# Altium project TMDX654GPEVM.PrjPcb (part 1 of 24)
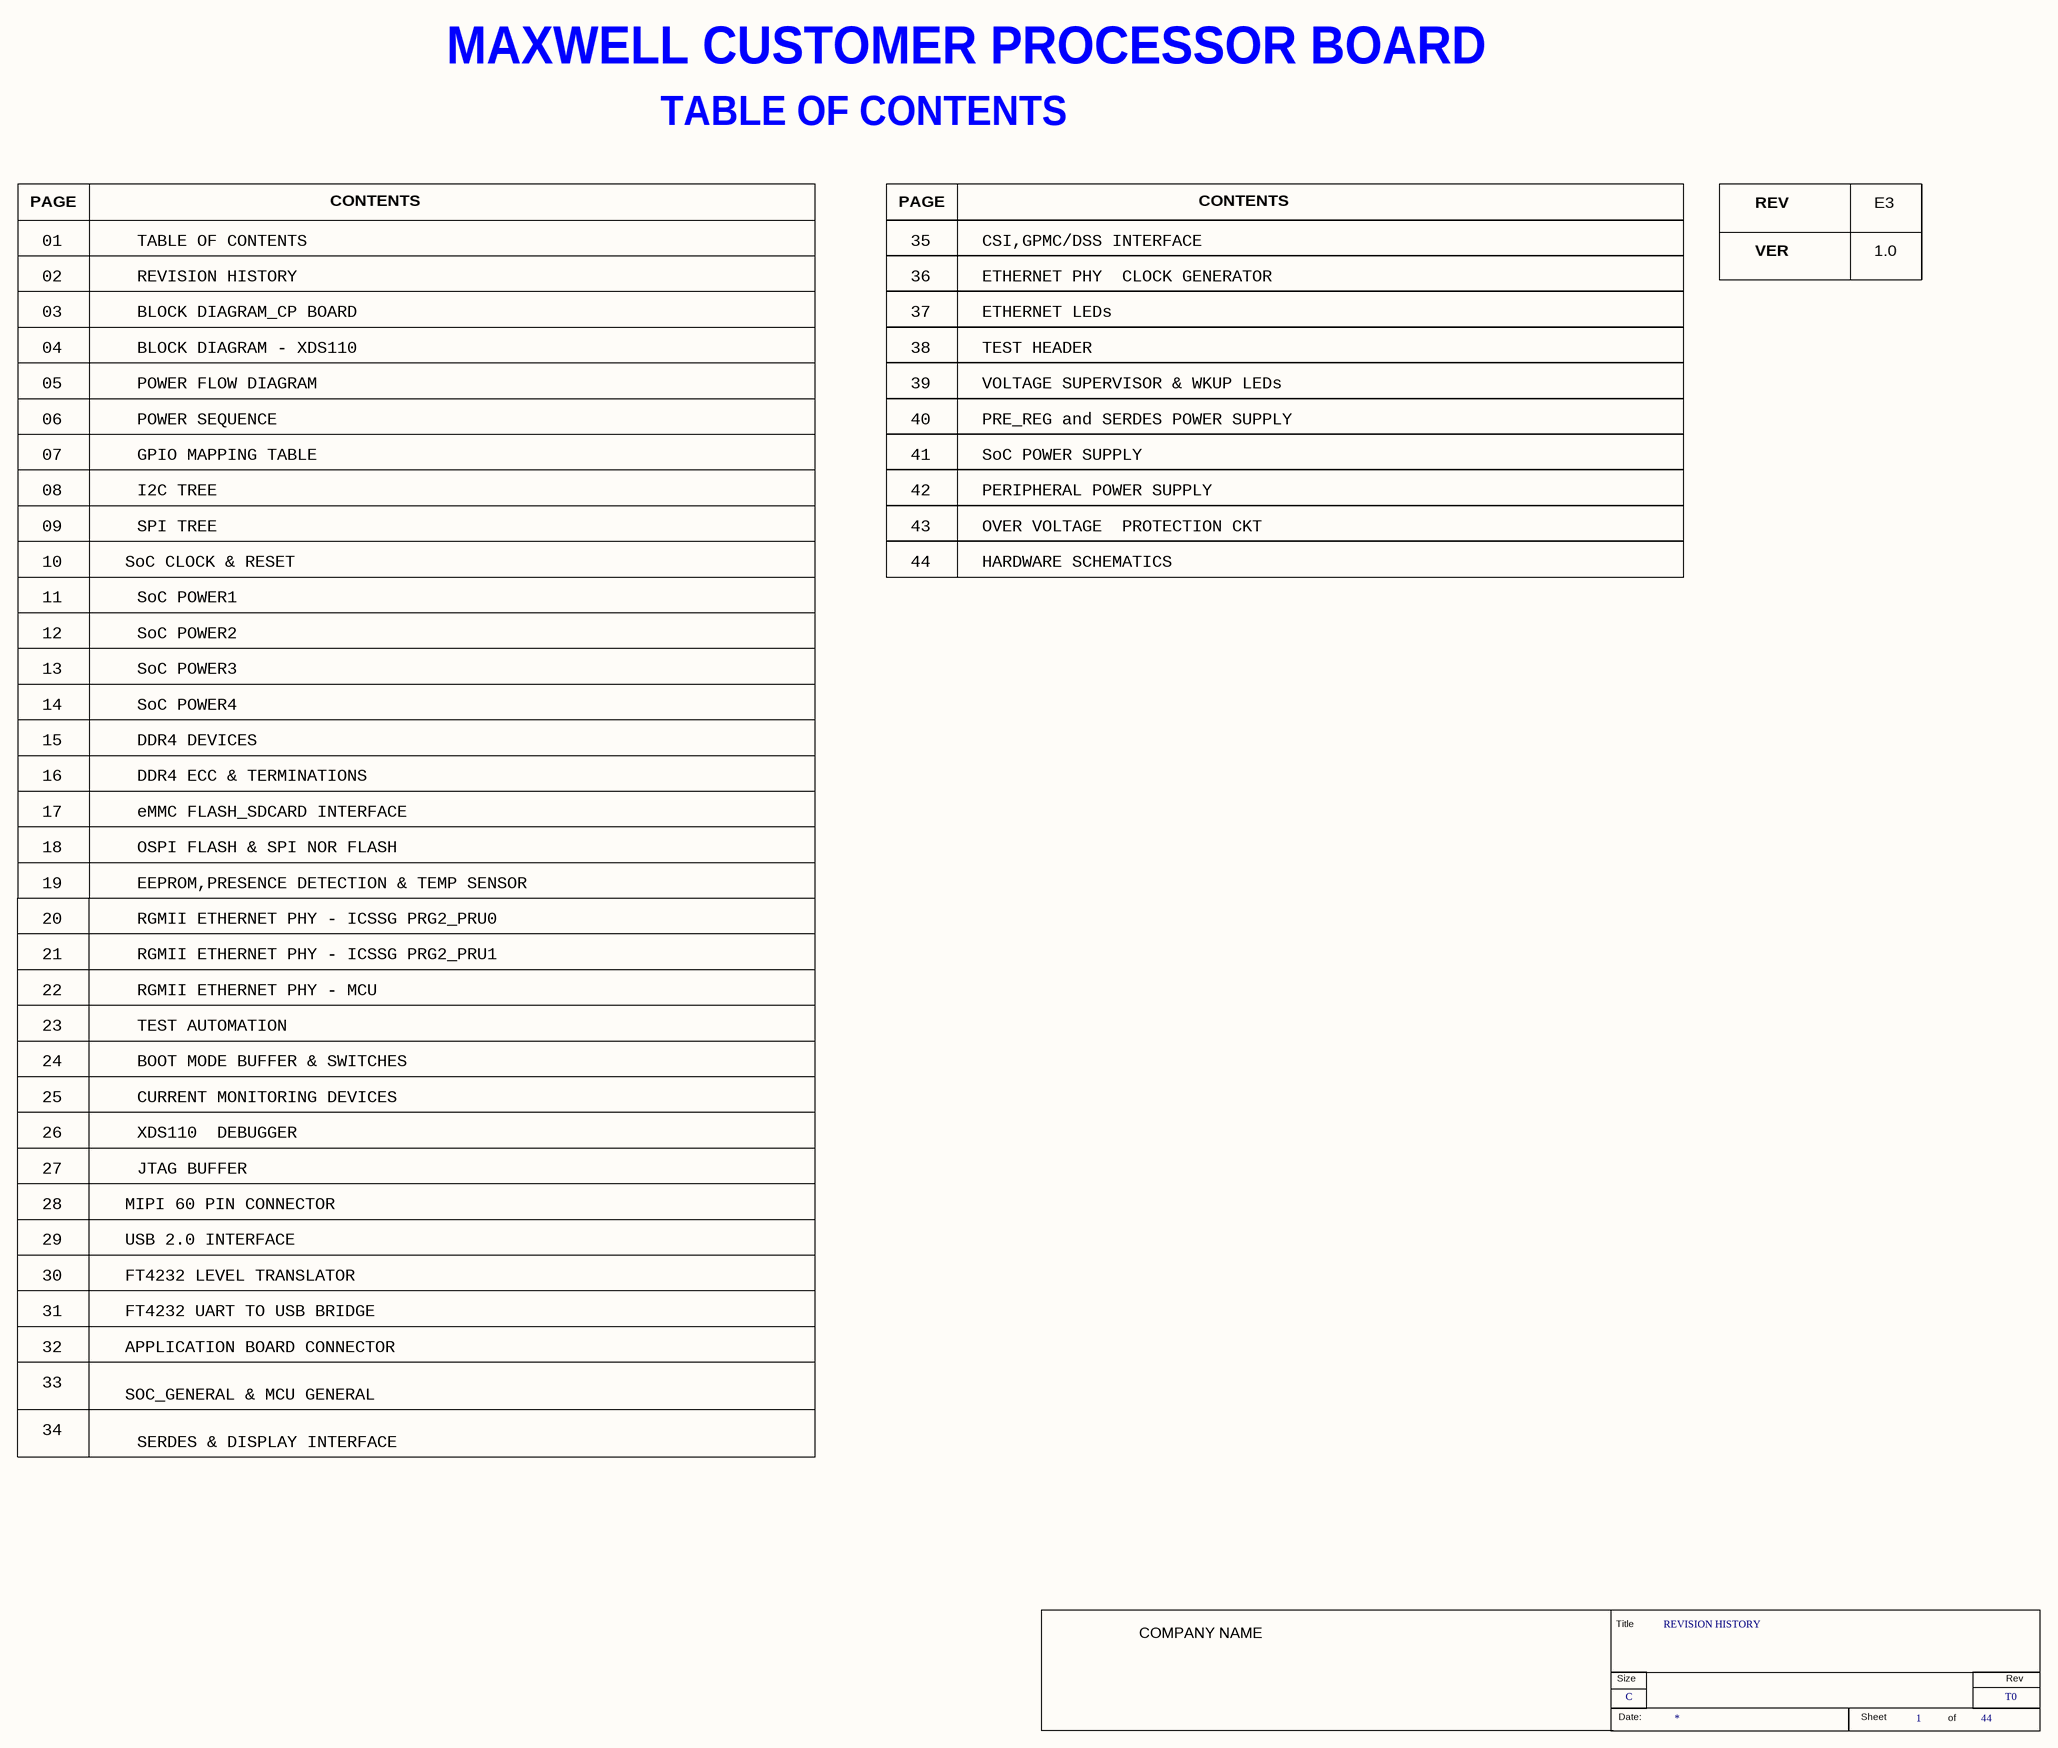
[diagram p0: 01-TABLE OF CONTENTS.SchDoc]
44 sheets, 1913 parts. Net scope: flat (ports and power ports of the same name join across sheets).
Board files: TMDX654GPEVM_REF_BRD.PcbDoc, Copy of DXF.PcbDoc
Sheets:
  01-TABLE OF CONTENTS.SchDoc
  02-REVISION HISTORY.SchDoc
  03-BLOCK DIAGRAM_CP BOARD.SchDoc
  04-BLOCK DIAGRAM - XDS110.SchDoc
  05-POWER FLOW DIAGRAM.SchDoc
  06-POWER SEQUENCE.SchDoc
  07-GPIO MAPPING TABLE.SchDoc
  08-I2C TREE.SchDoc
  09-SPI TREE.SchDoc
  10-SoC CLOCK AND RESET.SchDoc
  11-SoC POWER1.SchDoc
  12-SoC POWER2.SchDoc
  13-SoC POWER3.SchDoc
  14-SoC POWER4.SchDoc
  15-DDR4 DEVICES.SchDoc
  16-DDR4 ECC AND TERMINATIONS.SchDoc
  17-eMMC FLASH_SDCARD INTERFACE.SchDoc
  18-OSPI FLASH AND SPI NOR FLASH.SchDoc
  19-EEPROM,PRESENCE DETECTION & TEMP SENSOR.SchDoc
  20-RGMII ETHERNET PHY - ICSSG PRG2_PRU0.SchDoc
  21-RGMII ETHERNET PHY - ICSSG PRG2_PRU1.SchDoc
  22-RGMII ETHERNET PHY - MCU.SchDoc
  23-TEST AUTOMATION.SchDoc
  24-BOOT MODE BUFFER AND SWITCHES.SchDoc
  25-CURRENT MONITORING DEVICES.SchDoc
  26-XDS110 DEBUGGER.SchDoc
  27-JTAG BUFFER.SchDoc
  28-MIPI 60 PIN CONNECTOR.SchDoc
  29-USB 2.0 INTERFACE.SchDoc
  30-FT4232 LEVEL TRANSLATOR.SchDoc
  31-FT4232 UART TO USB BRIDG.SchDoc
  32-APPLICATION BOARD CONNECTOR.SchDoc
  33-SOC_GENERAL AND MCU GENERAL.SchDoc
  34-SERDES AND DISPLAY INTERFACE.SchDoc
  35-CSI-GPM-CDSS INTERFACE.SchDoc
  36-ETHERNET PHY CLOCK GENERATOR.SchDoc
  37-ETHERNET LEDs.SchDoc
  38-TEST HEADER.SchDoc
  39-VOLTAGE SUPERVISOR AND WKUP LEDs.SchDoc
  40-PRE_REG AND SERDES POWER SUPPLY.SchDoc
  41-SoC POWER SUPPLY.SchDoc
  42-PERIPHERAL POWER SUPPLY.SchDoc
  43-OVER VOLTAGE PROTECTION CKT.SchDoc
  44-HARDWARE SCHEMATICS.SchDoc

## Sheet 01-TABLE OF CONTENTS.SchDoc
size 513 x 386 mm

### Parts
(Parts that share a designator on the sheet are numbered #1, #2 ... from top to bottom, then left to right.)
*#1  RevCode: T0  Title: REVISION HISTORY  Page Size: C  Page Number: 1  Page Count: 44  (hidden comment: TRAINING_TITLEBLK_CSIZE)  (graphical)

### Notes on the sheet
- MAXWELL CUSTOMER PROCESSOR BOARD
- TABLE OF CONTENTS
- PAGE
- CONTENTS
- REV
- E3
- 01
- 35
- CSI,GPMC/DSS INTERFACE
- VER
- 1.0
- 02
- 03
- REVISION HISTORY
- BLOCK DIAGRAM_CP BOARD
- 36
- 37
- ETHERNET PHY  CLOCK GENERATOR
- ETHERNET LEDs
- 04
- 05
- BLOCK DIAGRAM - XDS110
- POWER FLOW DIAGRAM
- 38
- 39
- TEST HEADER
- VOLTAGE SUPERVISOR & WKUP LEDs
- 06
- POWER SEQUENCE
- 40
- PRE_REG and SERDES POWER SUPPLY
- 07
- 08
- I2C TREE
- GPIO MAPPING TABLE
- 41
- 42
- SoC POWER SUPPLY
- PERIPHERAL POWER SUPPLY
- 09
- 10
- SoC CLOCK & RESET
- SPI TREE
- 43
- 44
- OVER VOLTAGE  PROTECTION CKT
- HARDWARE SCHEMATICS
- 11
- SoC POWER1
- 12
- 13
- SoC POWER3
- SoC POWER2
- 14
- 15
- DDR4 DEVICES
- SoC POWER4
- 16
- DDR4 ECC & TERMINATIONS
- 17
- 18
- eMMC FLASH_SDCARD INTERFACE
- OSPI FLASH & SPI NOR FLASH
- 20
- 19
- RGMII ETHERNET PHY - ICSSG PRG2_PRU0
- EEPROM,PRESENCE DETECTION & TEMP SENSOR
- 21
- RGMII ETHERNET PHY - ICSSG PRG2_PRU1
- 22
- 23
- TEST AUTOMATION
- RGMII ETHERNET PHY - MCU
- 24
- 25
- BOOT MODE BUFFER & SWITCHES
- CURRENT MONITORING DEVICES
- 26
- XDS110  DEBUGGER
- 27
- 28
- MIPI 60 PIN CONNECTOR
- JTAG BUFFER
- 29
- 30
- FT4232 LEVEL TRANSLATOR
- USB 2.0 INTERFACE
- 31
- FT4232 UART TO USB BRIDGE
- 32
- 33
- APPLICATION BOARD CONNECTOR
- SOC_GENERAL & MCU GENERAL
- 34
- SERDES & DISPLAY INTERFACE
- (in symbol TRAINING_TITLEBLK_CSIZE) Title; COMPANY NAME; Size; Rev; Date:; Sheet; of

### Library data of the parts
*#1 = TRAINING_TITLEBLK_CSIZE: Issue: 1.0; Page Create Date: Jan  8, 2022; Page Modify Date: *

## Sheet 02-REVISION HISTORY.SchDoc
size 513 x 386 mm
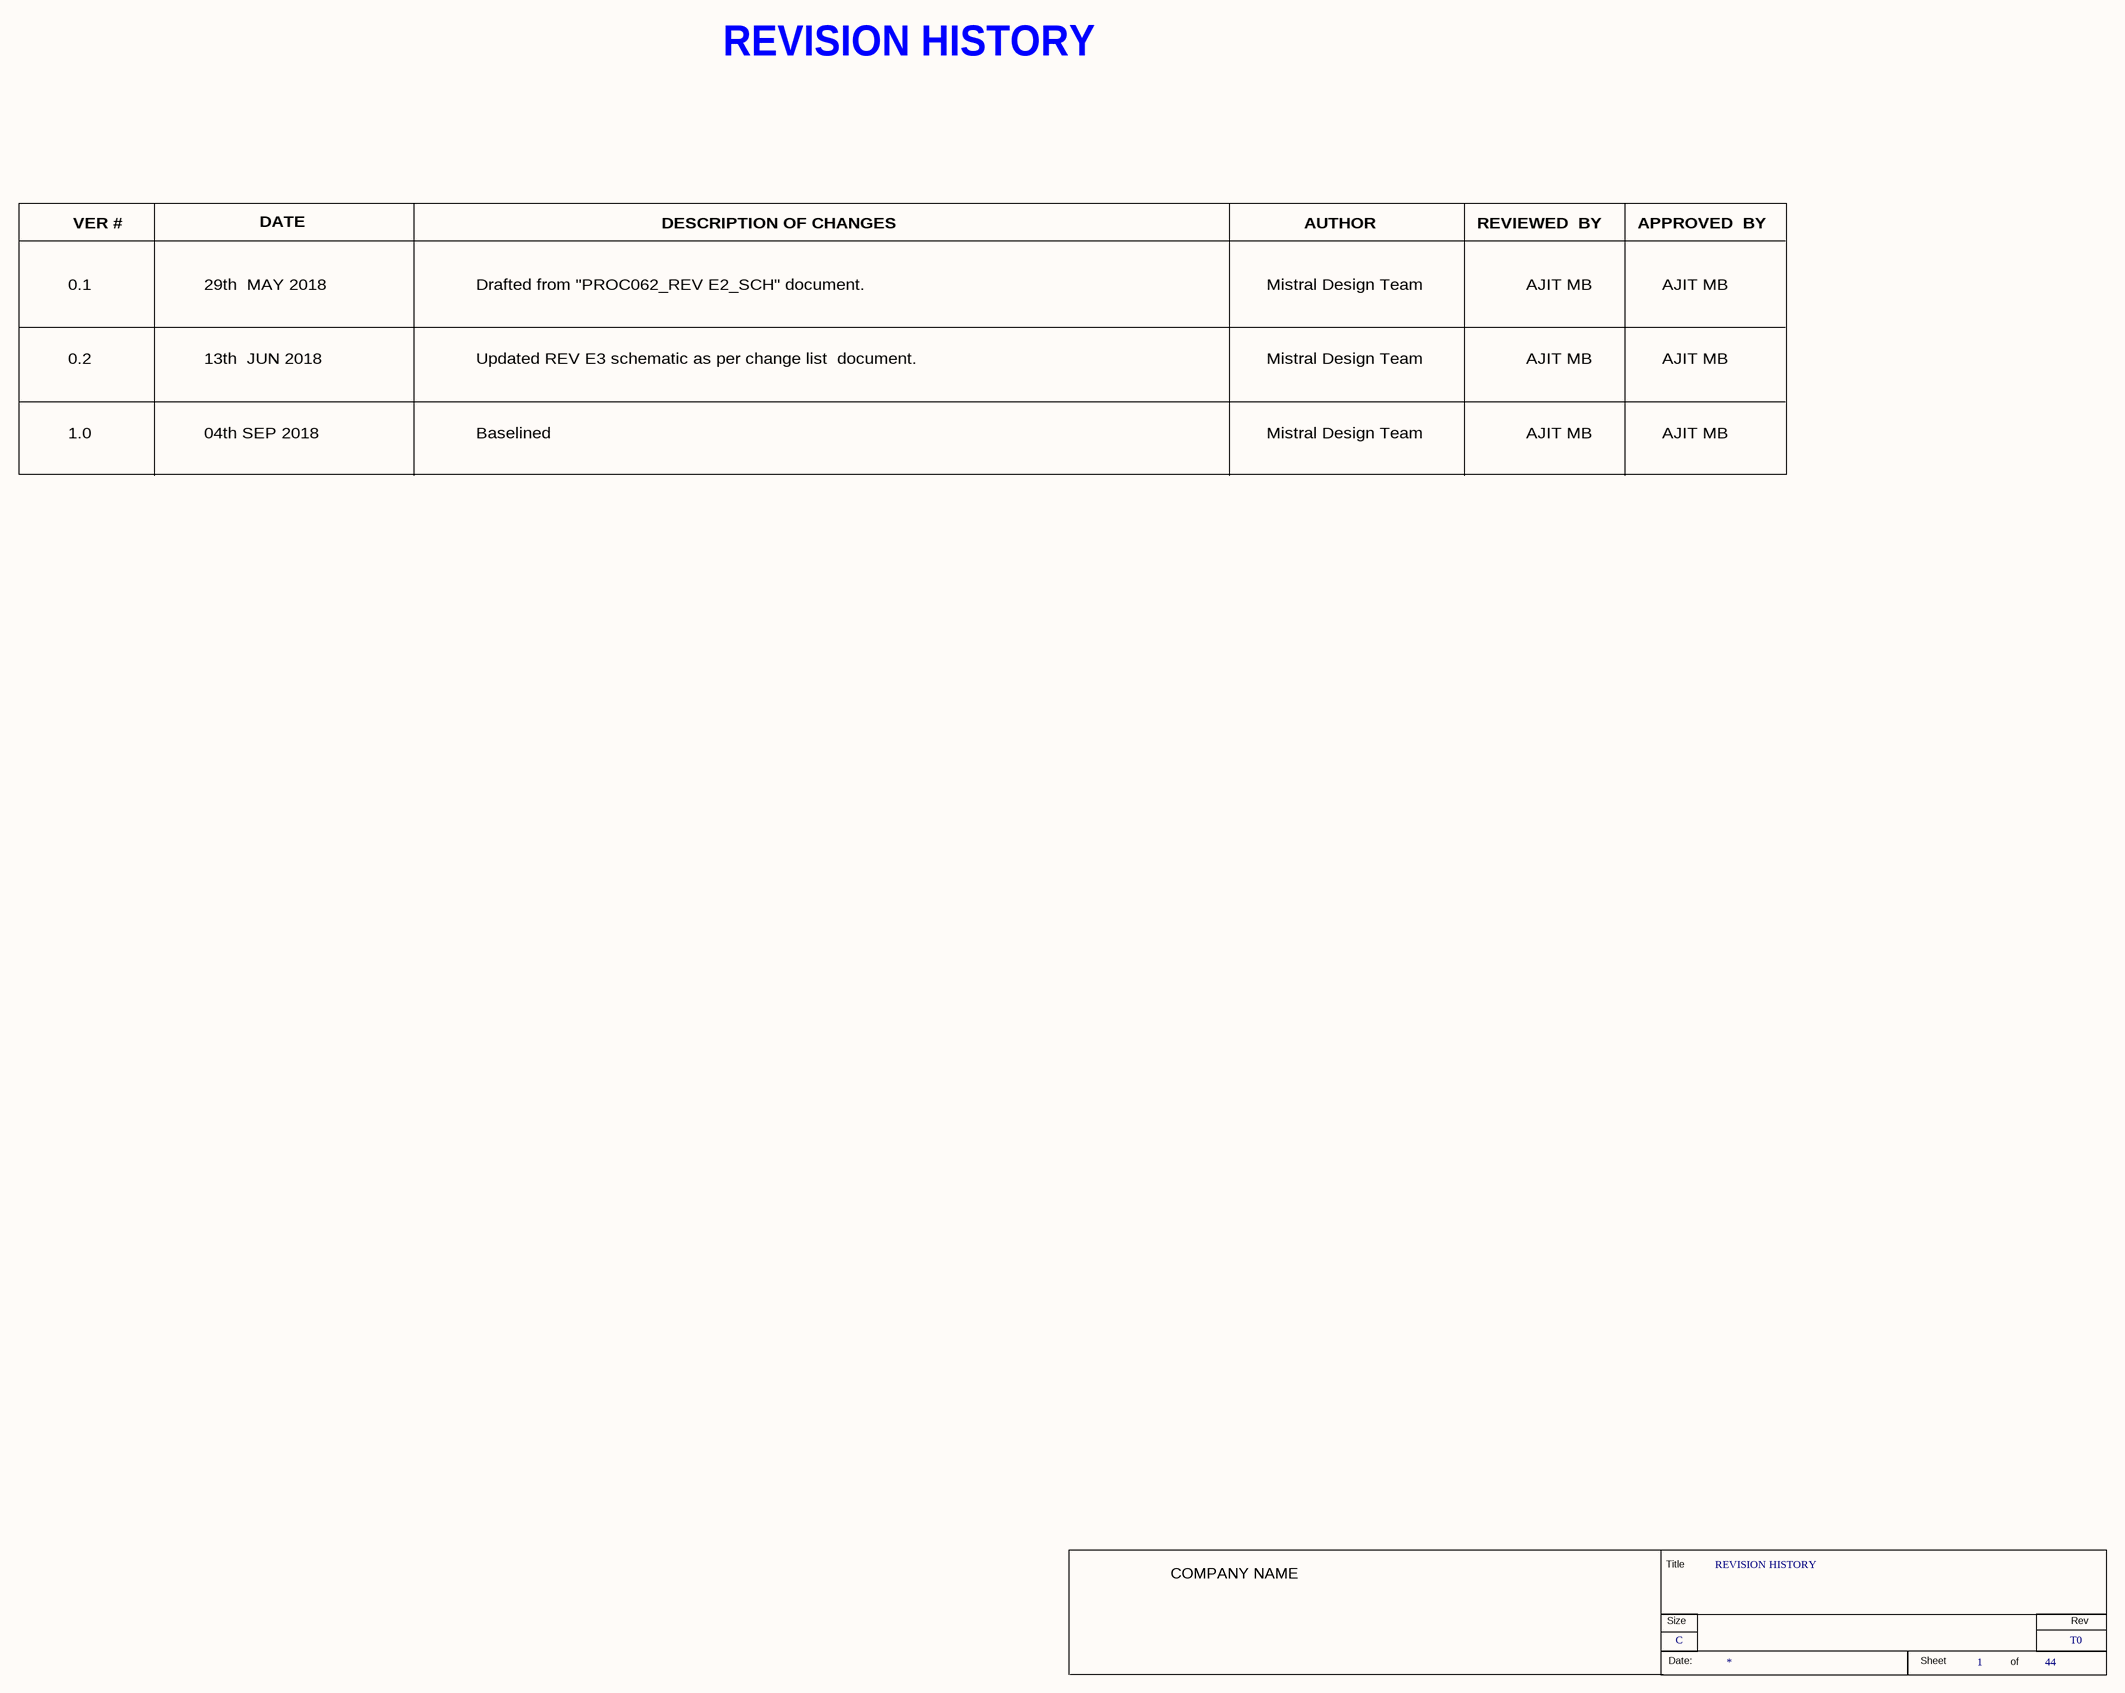
[diagram p1: 02-REVISION HISTORY.SchDoc]

### Parts
(Parts that share a designator on the sheet are numbered #1, #2 ... from top to bottom, then left to right.)
*#2  RevCode: T0  Title: REVISION HISTORY  Page Size: C  Page Number: 1  Page Count: 44  (hidden comment: TRAINING_TITLEBLK_CSIZE)  (graphical)

### Notes on the sheet
- REVISION HISTORY
- VER #
- DATE
- DESCRIPTION OF CHANGES
- AUTHOR
- REVIEWED  BY
- APPROVED  BY
- 0.1
- 29th  MAY 2018
- Drafted from "PROC062_REV E2_SCH" document.
- Mistral Design Team
- AJIT MB
- 0.2
- 13th  JUN 2018
- Updated REV E3 schematic as per change list  document.
- 1.0
- 04th SEP 2018
- Baselined
- (in symbol TRAINING_TITLEBLK_CSIZE) Title; COMPANY NAME; Size; Rev; Date:; Sheet; of

### Library data of the parts
*#2 = TRAINING_TITLEBLK_CSIZE: Issue: 1.0; Page Create Date: Jan  8, 2022; Page Modify Date: *

## Sheet 03-BLOCK DIAGRAM_CP BOARD.SchDoc
size 513 x 386 mm
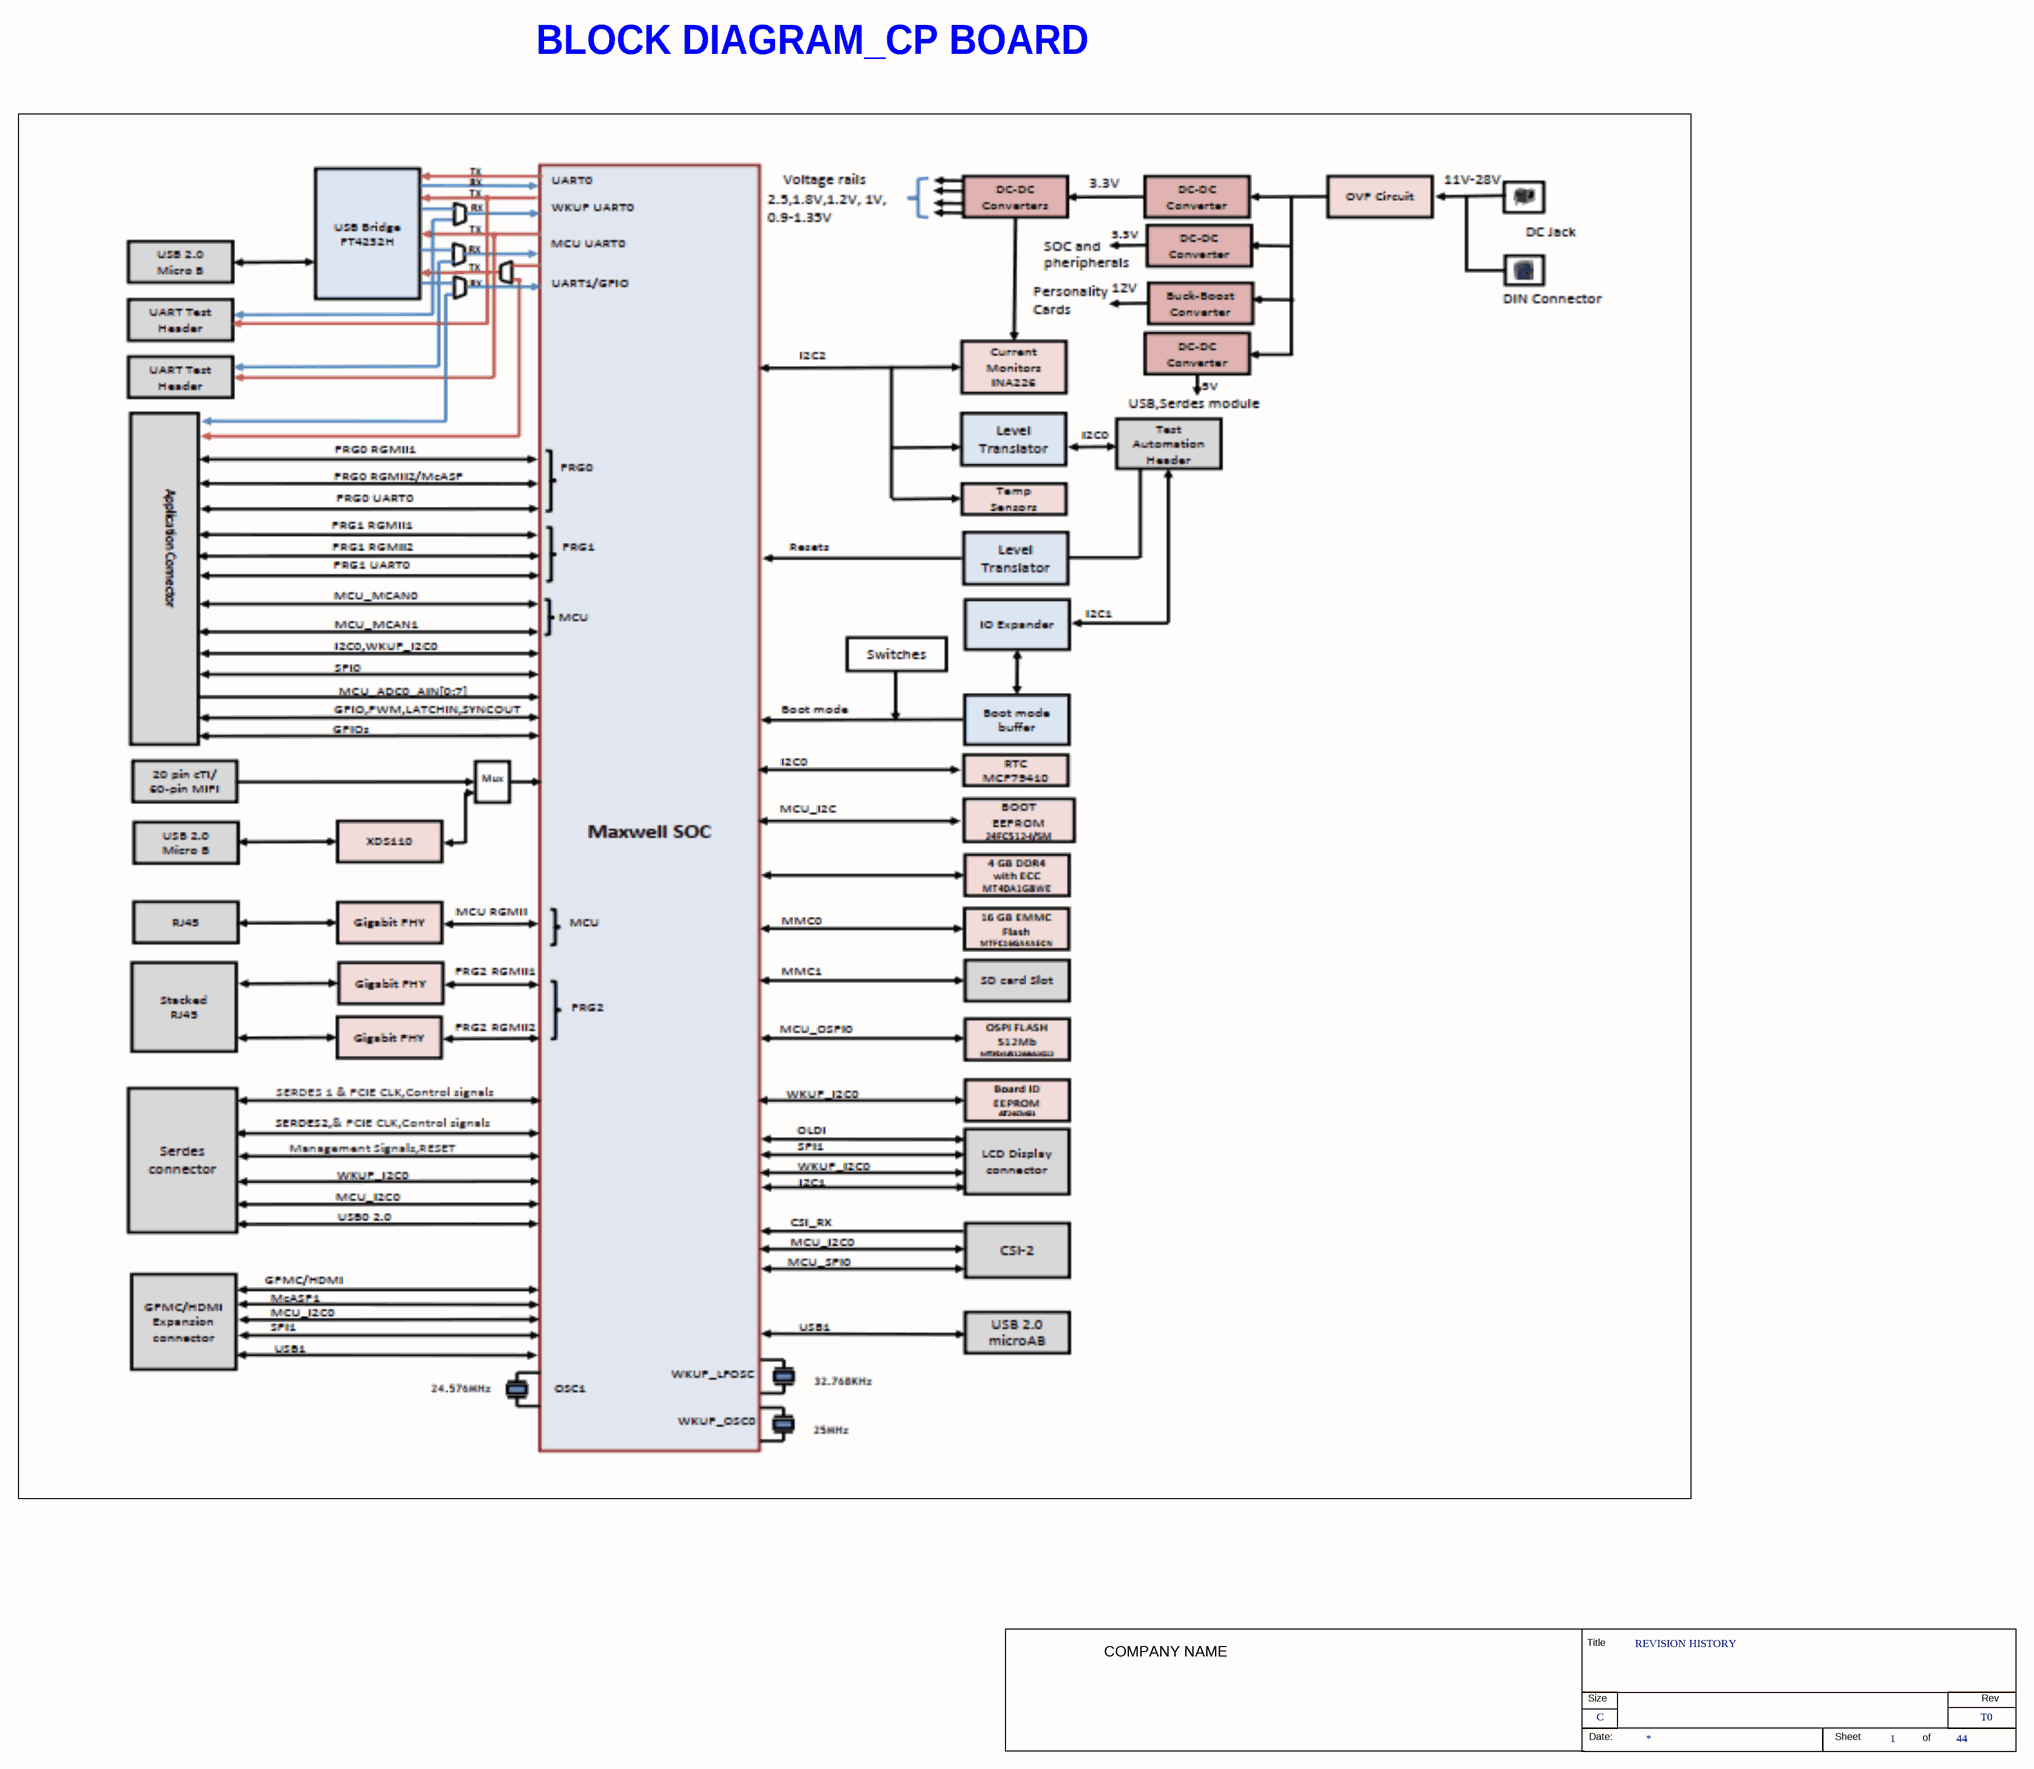
[diagram p2: 03-BLOCK DIAGRAM_CP BOARD.SchDoc]

### Parts
(Parts that share a designator on the sheet are numbered #1, #2 ... from top to bottom, then left to right.)
*#3  RevCode: T0  Title: REVISION HISTORY  Page Size: C  Page Number: 1  Page Count: 44  (hidden comment: TRAINING_TITLEBLK_CSIZE)  (graphical)

### Notes on the sheet
- BLOCK DIAGRAM_CP BOARD
- (in symbol TRAINING_TITLEBLK_CSIZE) Title; COMPANY NAME; Size; Rev; Date:; Sheet; of

### Library data of the parts
*#3 = TRAINING_TITLEBLK_CSIZE: Issue: 1.0; Page Create Date: Jan  8, 2022; Page Modify Date: *

## Sheet 04-BLOCK DIAGRAM - XDS110.SchDoc
size 513 x 386 mm
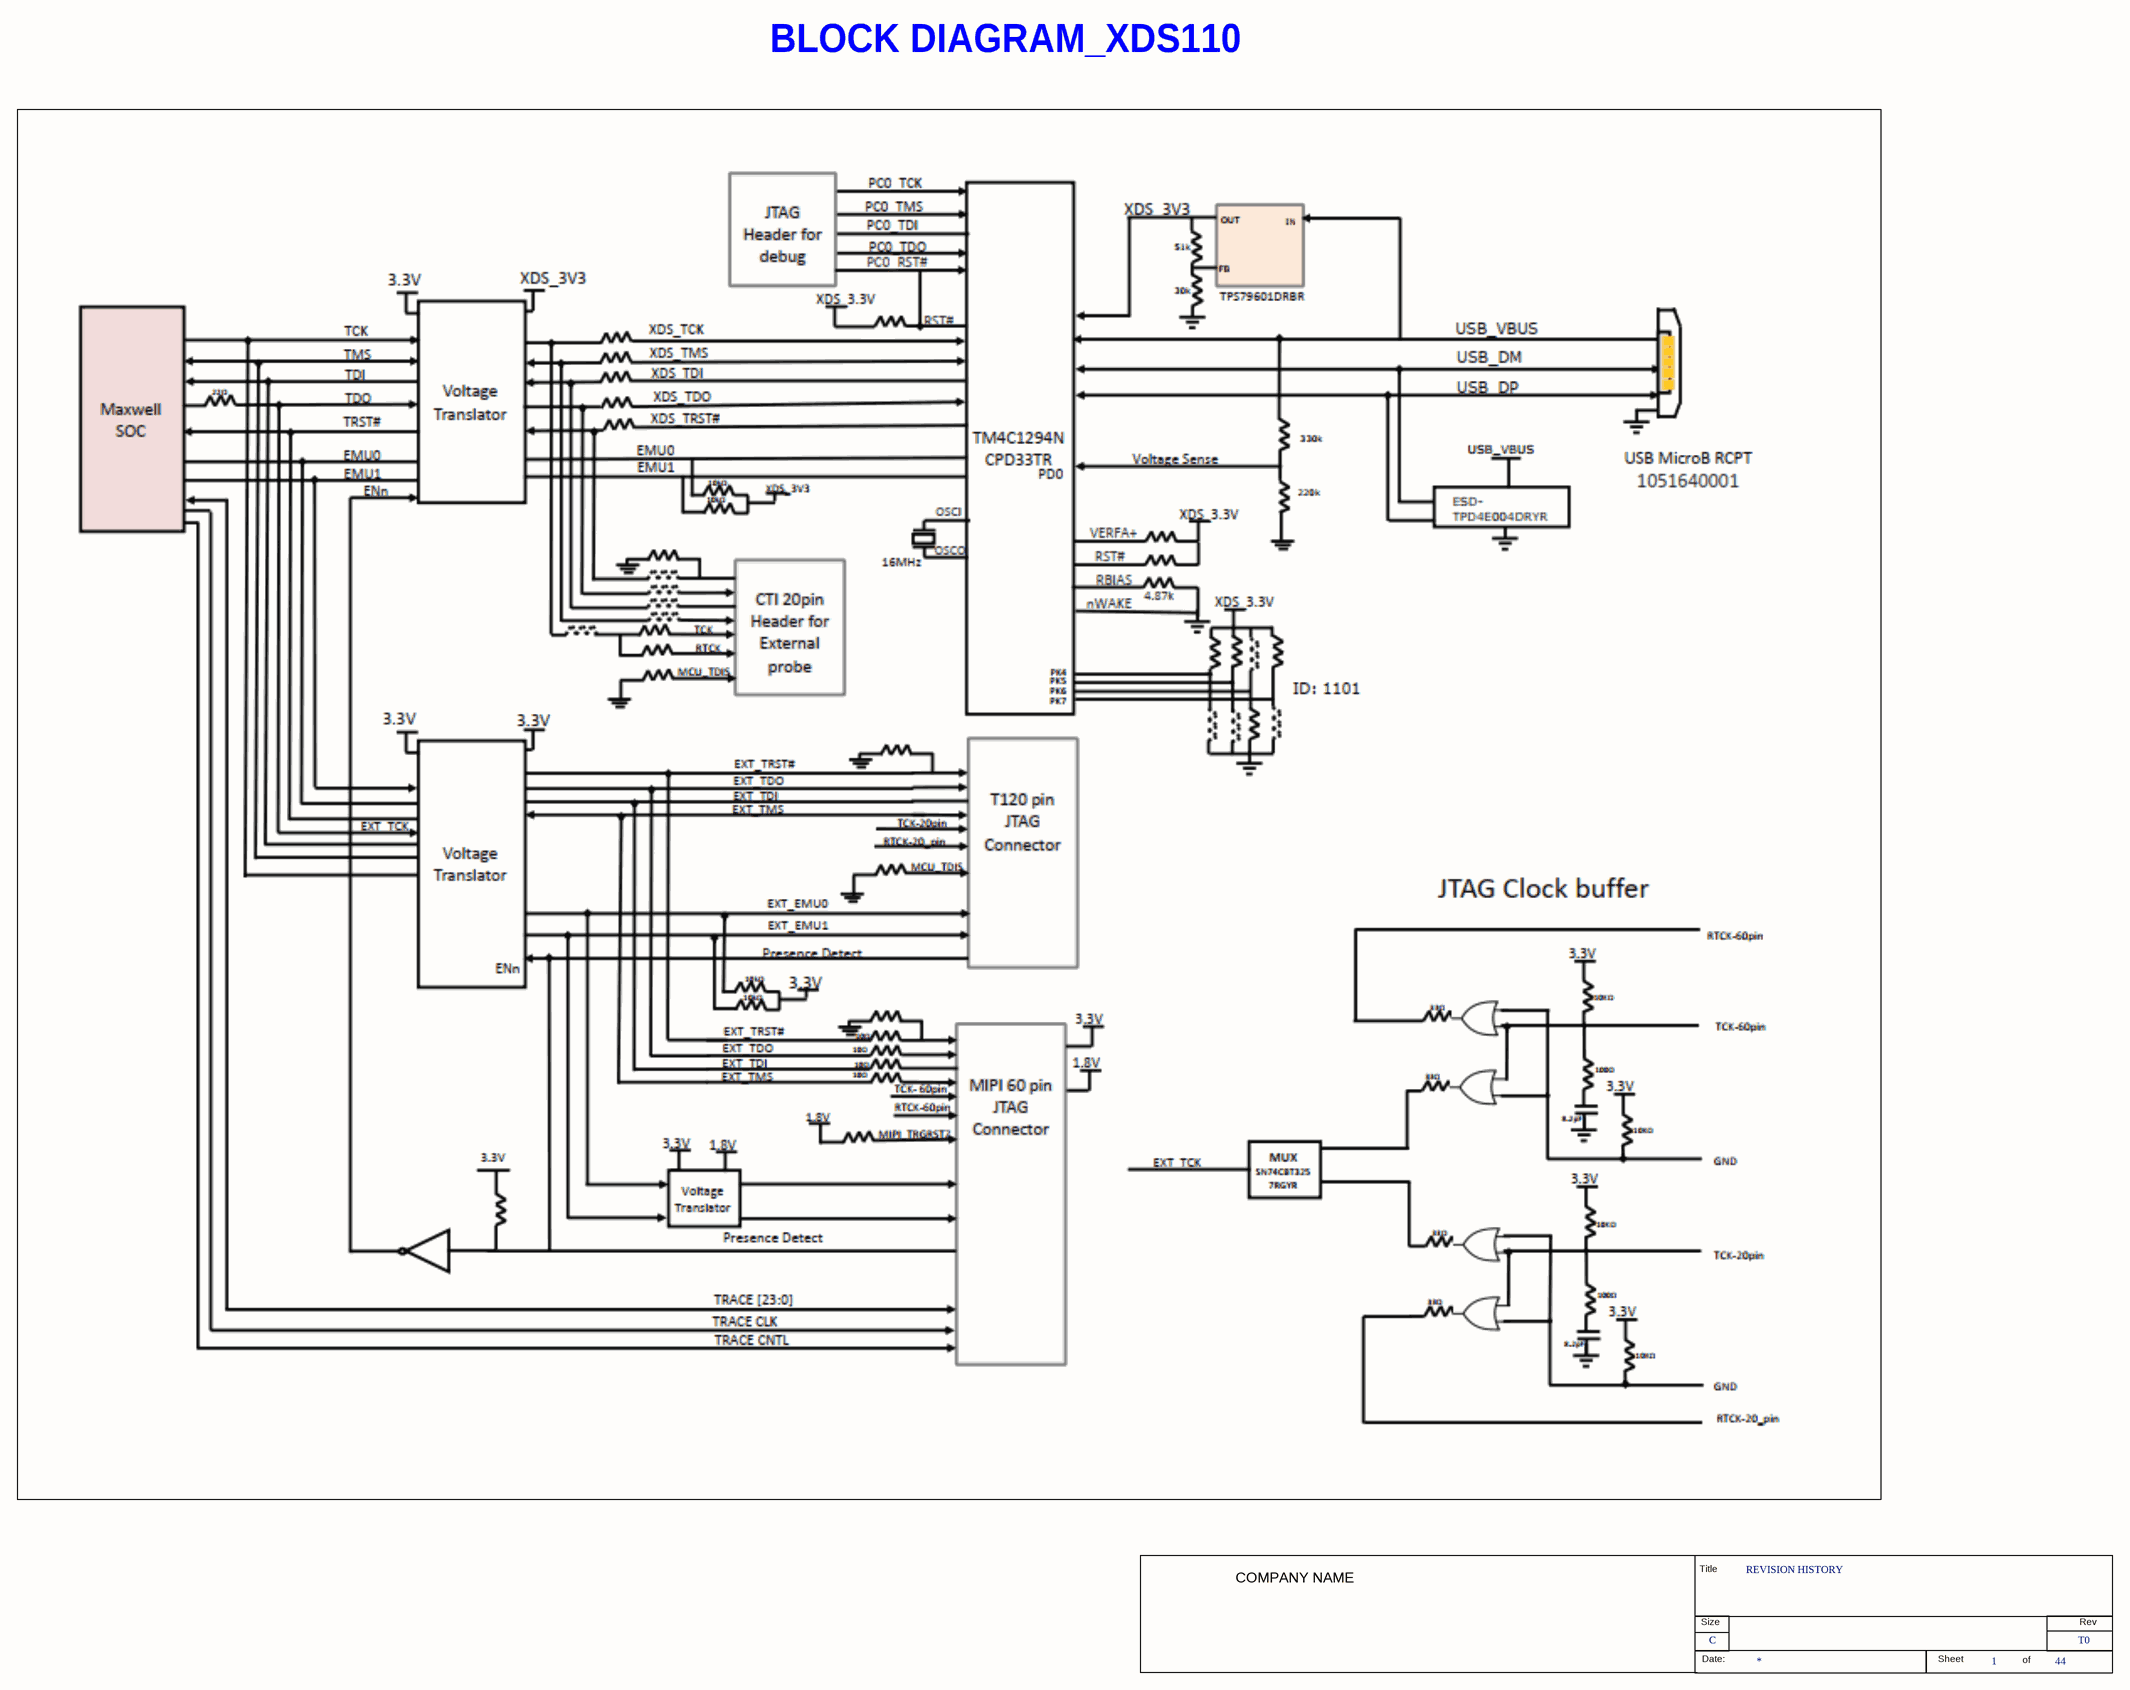
[diagram p3: 04-BLOCK DIAGRAM - XDS110.SchDoc]

### Parts
(Parts that share a designator on the sheet are numbered #1, #2 ... from top to bottom, then left to right.)
*#4  RevCode: T0  Title: REVISION HISTORY  Page Size: C  Page Number: 1  Page Count: 44  (hidden comment: TRAINING_TITLEBLK_CSIZE)  (graphical)

### Notes on the sheet
- BLOCK DIAGRAM_XDS110
- (in symbol TRAINING_TITLEBLK_CSIZE) Title; COMPANY NAME; Size; Rev; Date:; Sheet; of

### Library data of the parts
*#4 = TRAINING_TITLEBLK_CSIZE: Issue: 1.0; Page Create Date: Jan  8, 2022; Page Modify Date: *

## Sheet 05-POWER FLOW DIAGRAM.SchDoc
size 513 x 386 mm
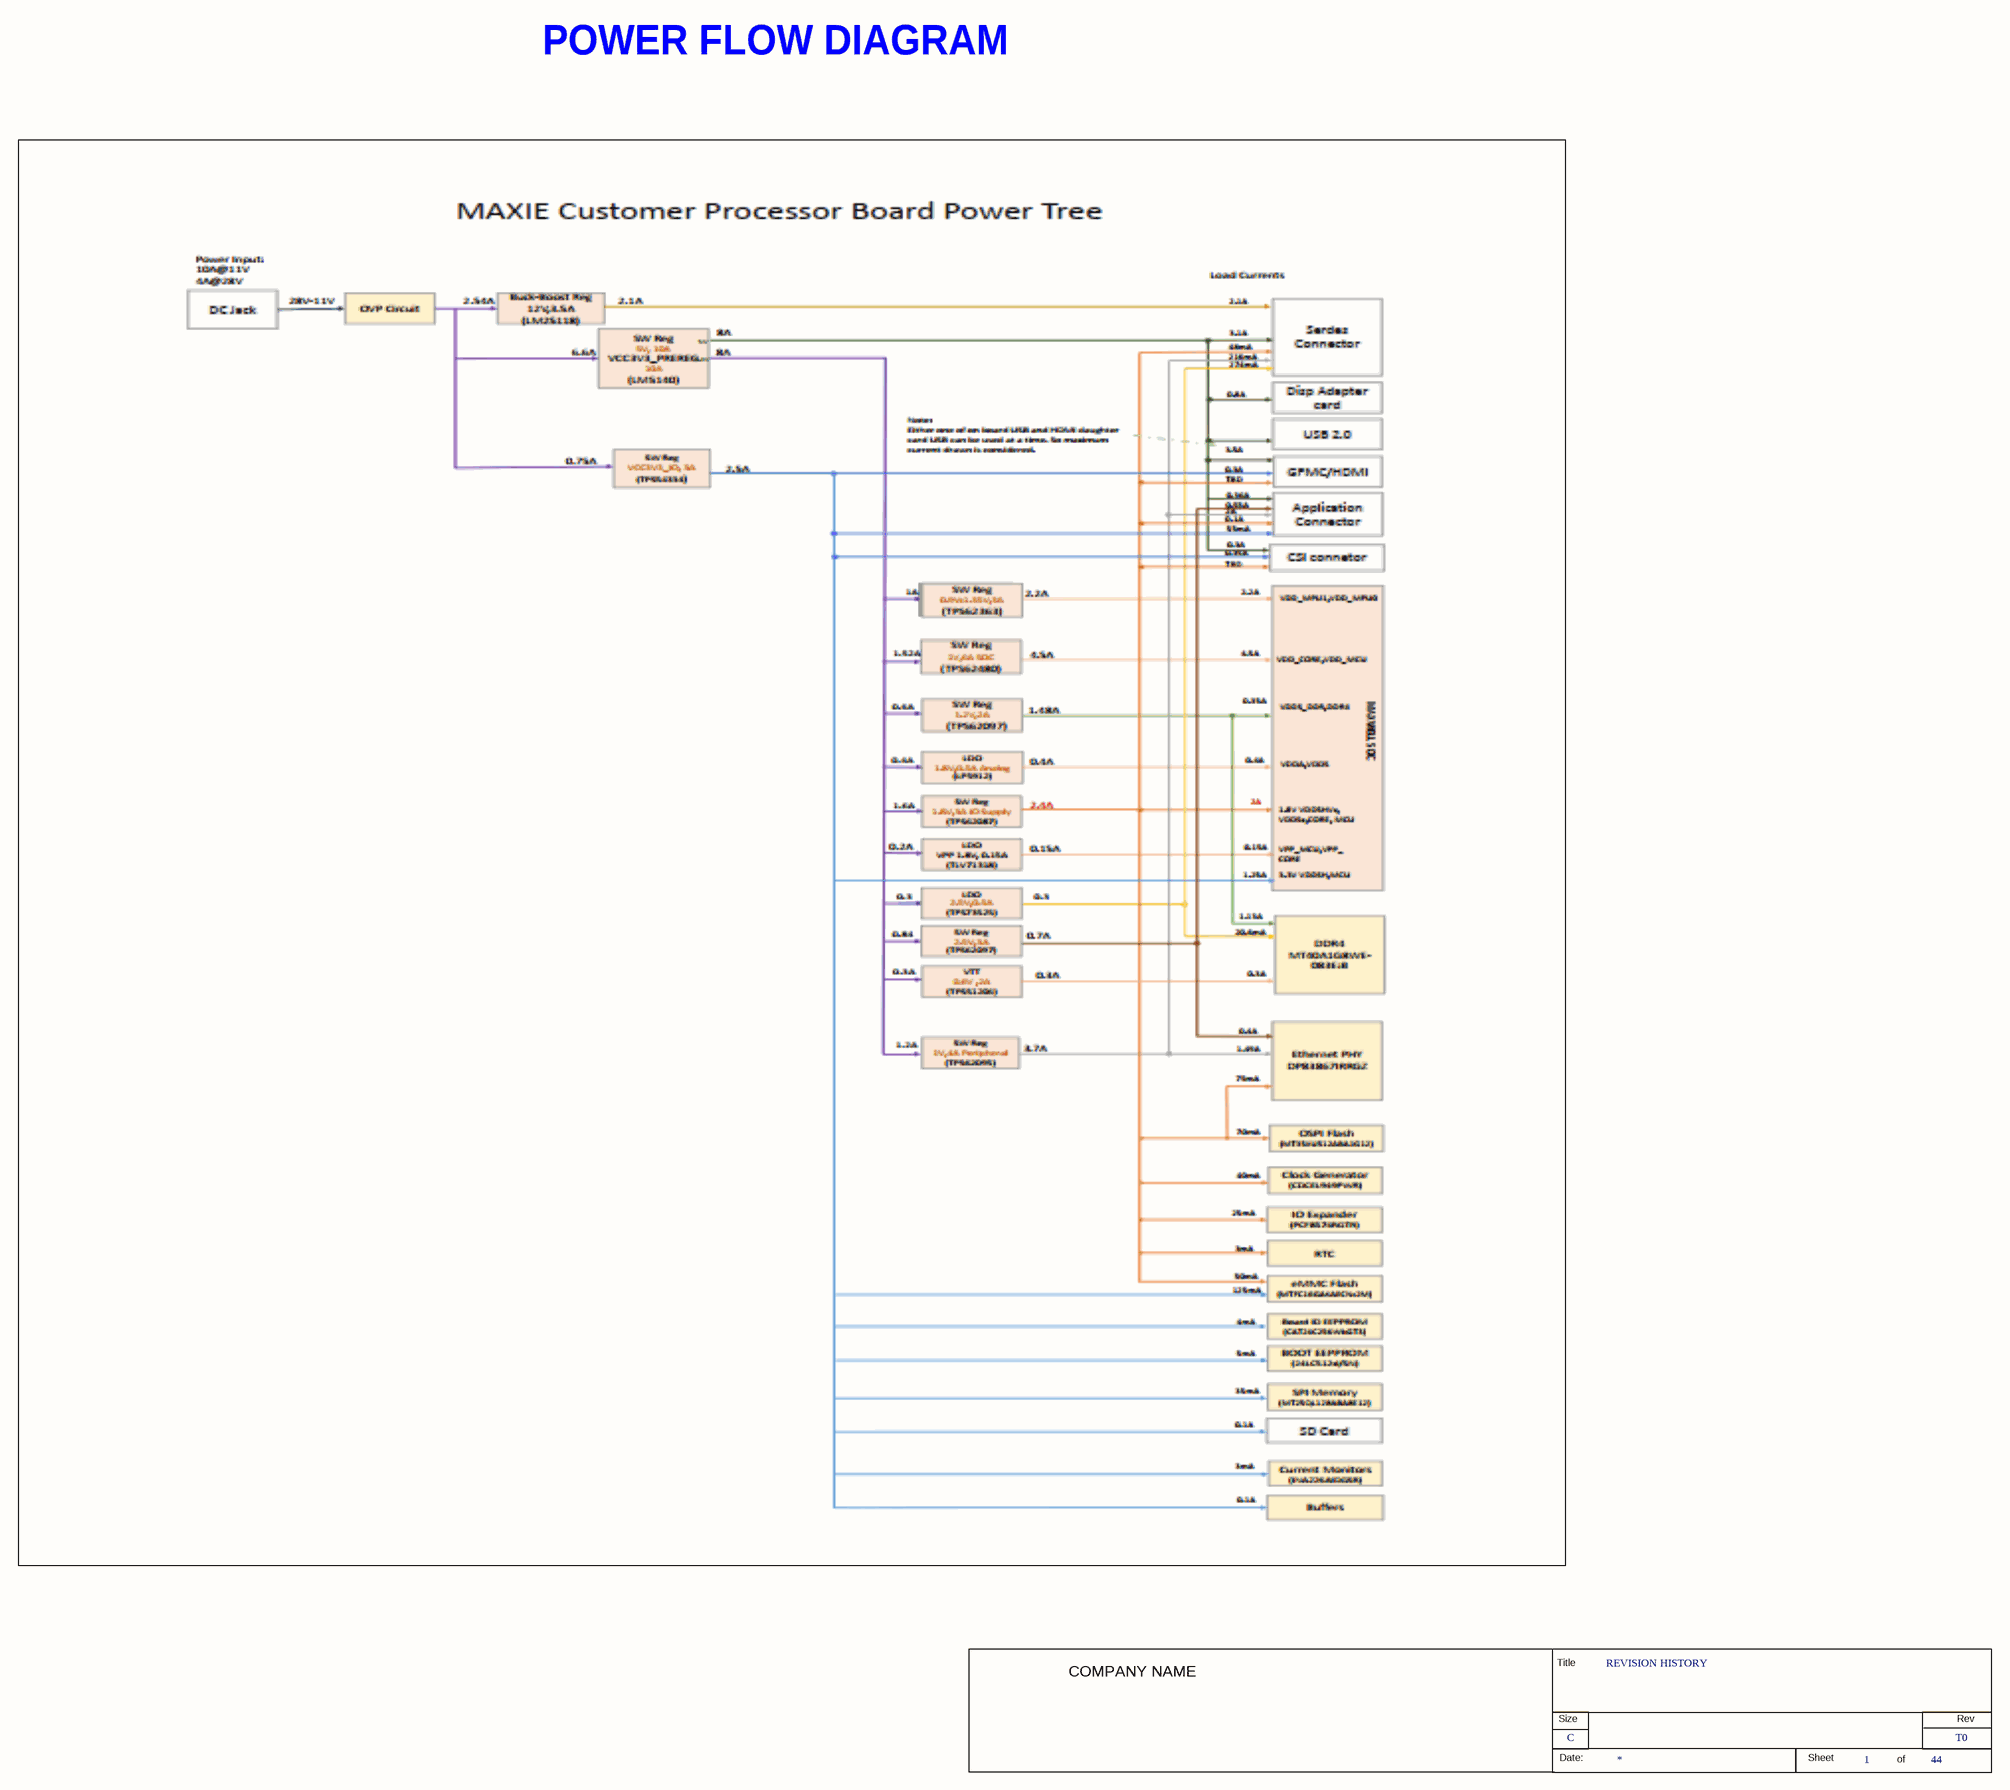
[diagram p4: 05-POWER FLOW DIAGRAM.SchDoc]

### Parts
(Parts that share a designator on the sheet are numbered #1, #2 ... from top to bottom, then left to right.)
*#5  RevCode: T0  Title: REVISION HISTORY  Page Size: C  Page Number: 1  Page Count: 44  (hidden comment: TRAINING_TITLEBLK_CSIZE)  (graphical)

### Notes on the sheet
- POWER FLOW DIAGRAM
- (in symbol TRAINING_TITLEBLK_CSIZE) Title; COMPANY NAME; Size; Rev; Date:; Sheet; of

### Library data of the parts
*#5 = TRAINING_TITLEBLK_CSIZE: Issue: 1.0; Page Create Date: Jan  8, 2022; Page Modify Date: *

## Sheet 06-POWER SEQUENCE.SchDoc
size 513 x 386 mm
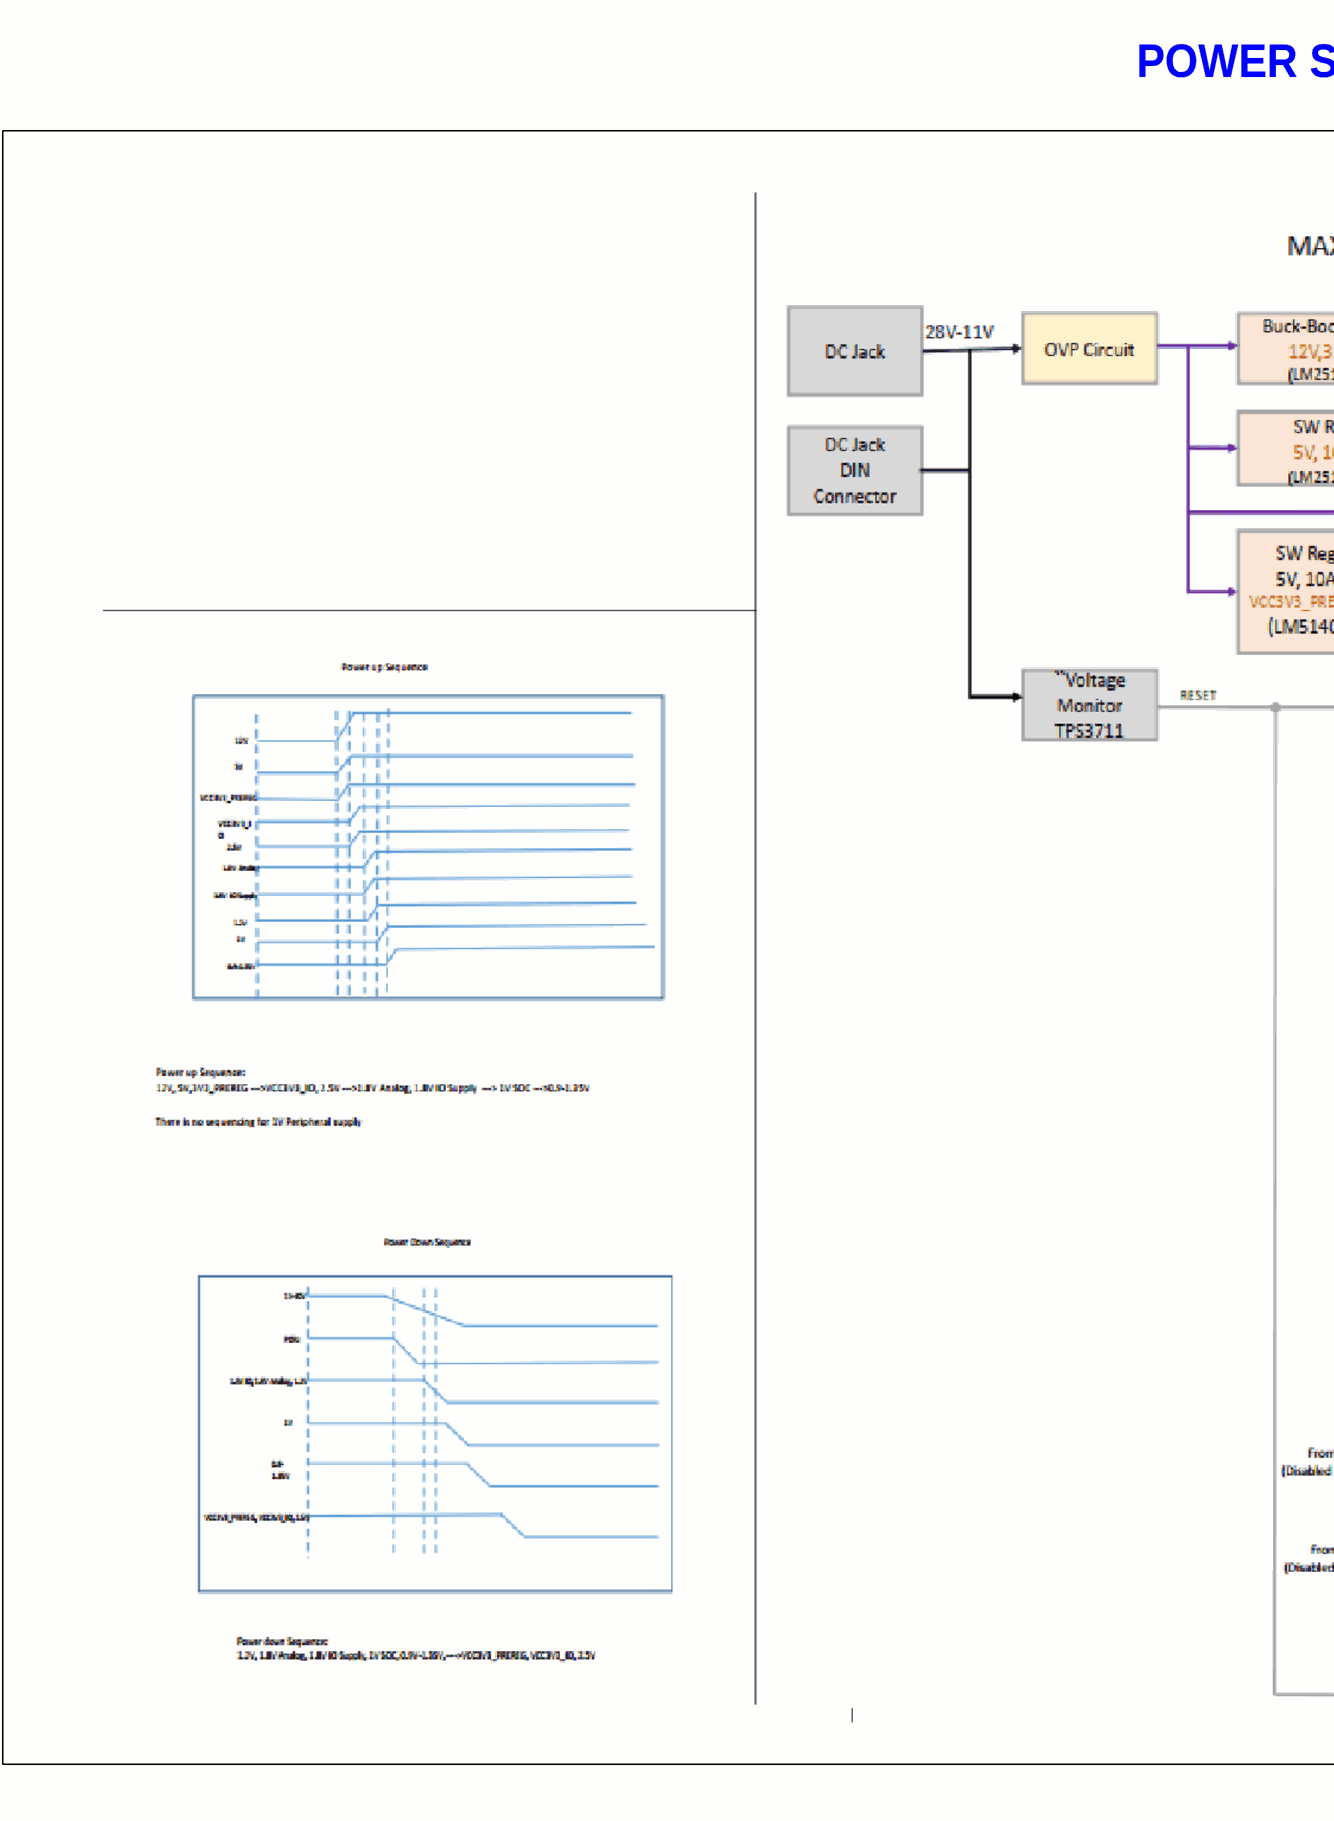
[diagram p5: 06-POWER SEQUENCE.SchDoc, left]
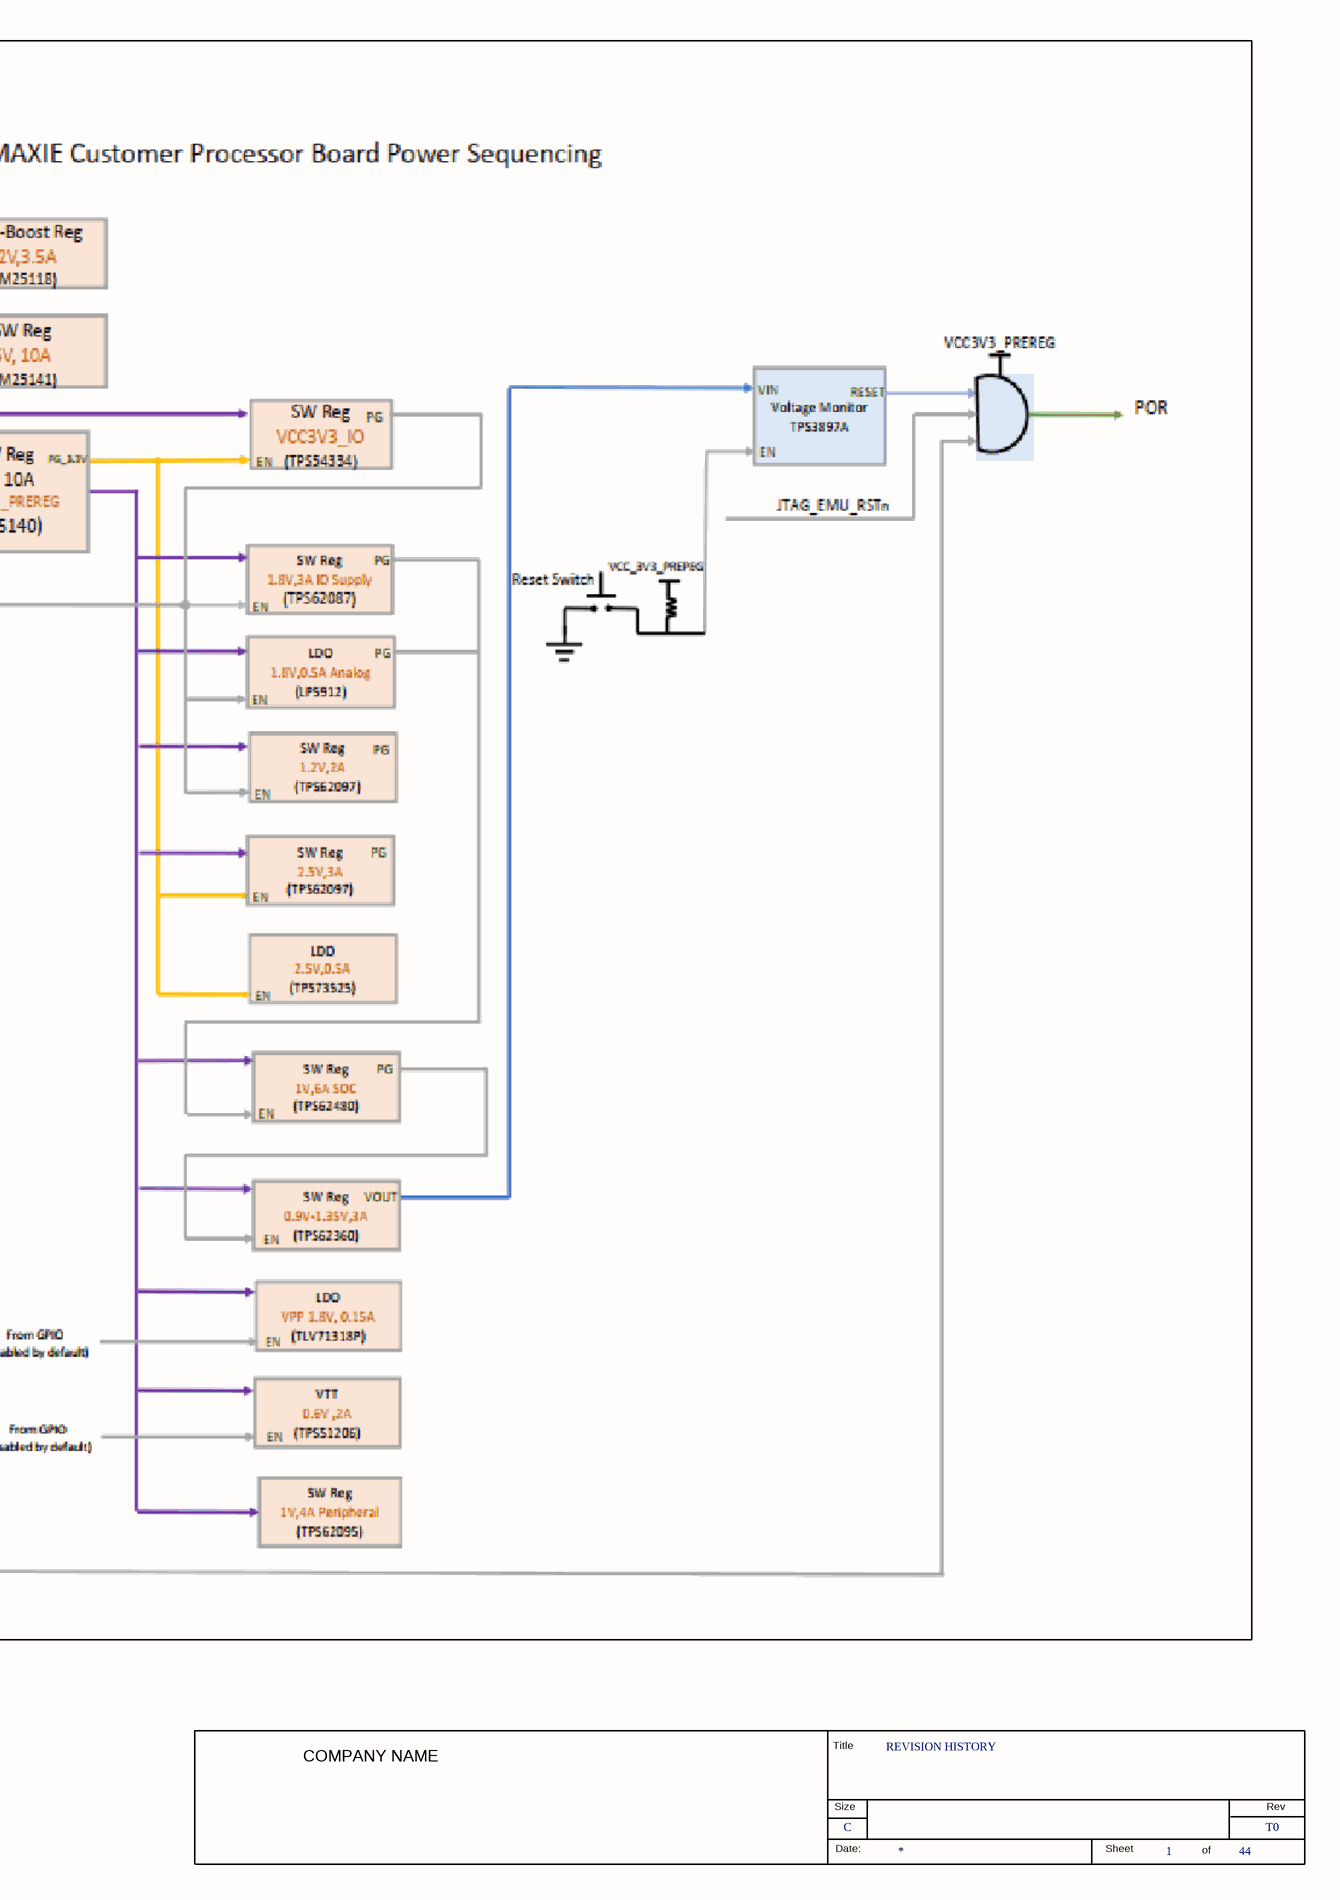
[diagram p6: 06-POWER SEQUENCE.SchDoc, right]

### Parts
(Parts that share a designator on the sheet are numbered #1, #2 ... from top to bottom, then left to right.)
*#6  RevCode: T0  Title: REVISION HISTORY  Page Size: C  Page Number: 1  Page Count: 44  (hidden comment: TRAINING_TITLEBLK_CSIZE)  (graphical)

### Notes on the sheet
- POWER SEQUENCE
- (in symbol TRAINING_TITLEBLK_CSIZE) Title; COMPANY NAME; Size; Rev; Date:; Sheet; of

### Library data of the parts
*#6 = TRAINING_TITLEBLK_CSIZE: Issue: 1.0; Page Create Date: Jan  8, 2022; Page Modify Date: *

## Sheet 07-GPIO MAPPING TABLE.SchDoc
size 513 x 386 mm
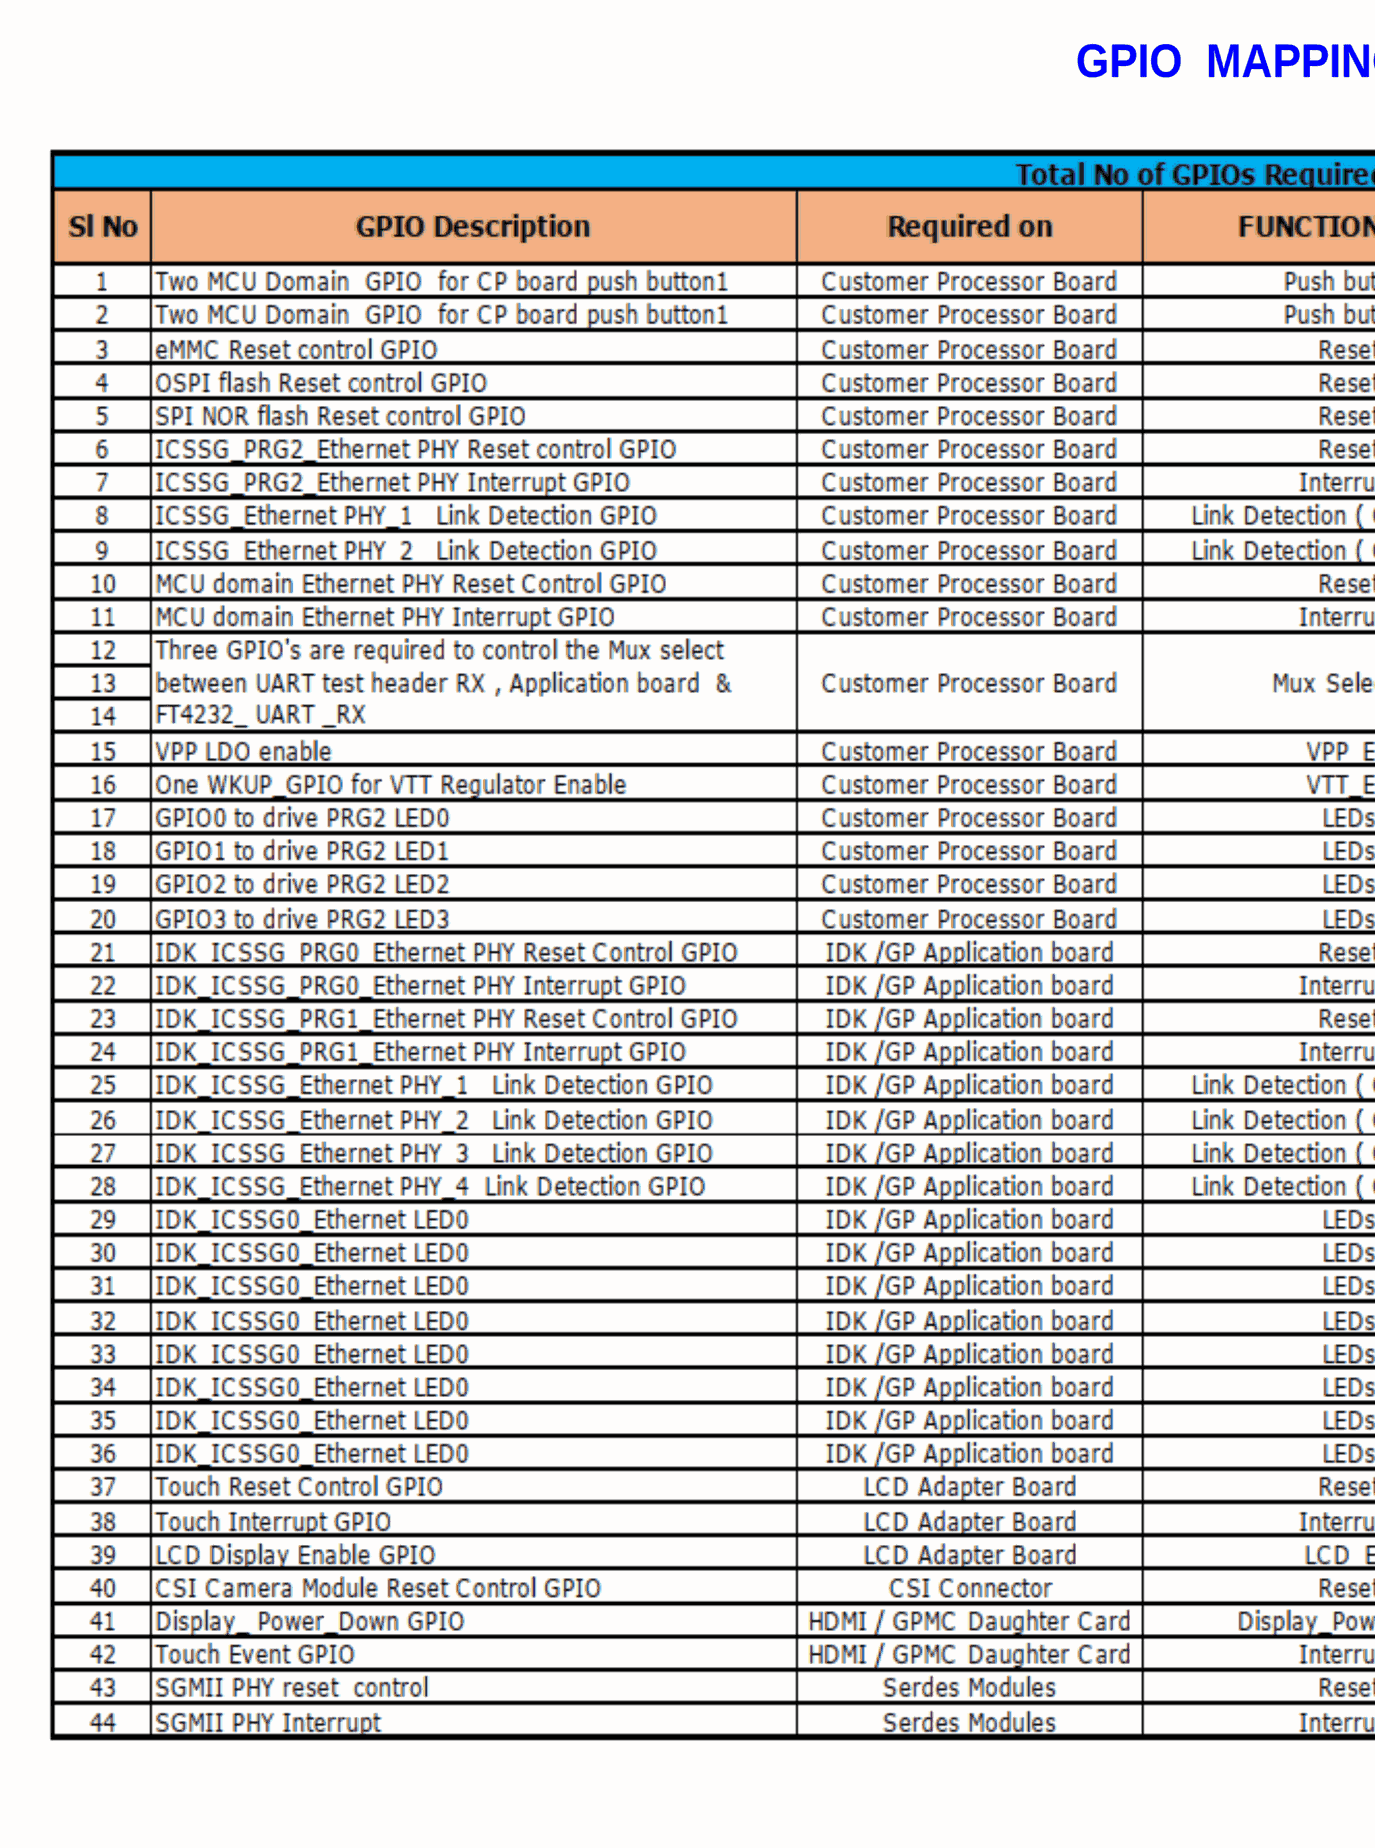
[diagram p7: 07-GPIO MAPPING TABLE.SchDoc, left]
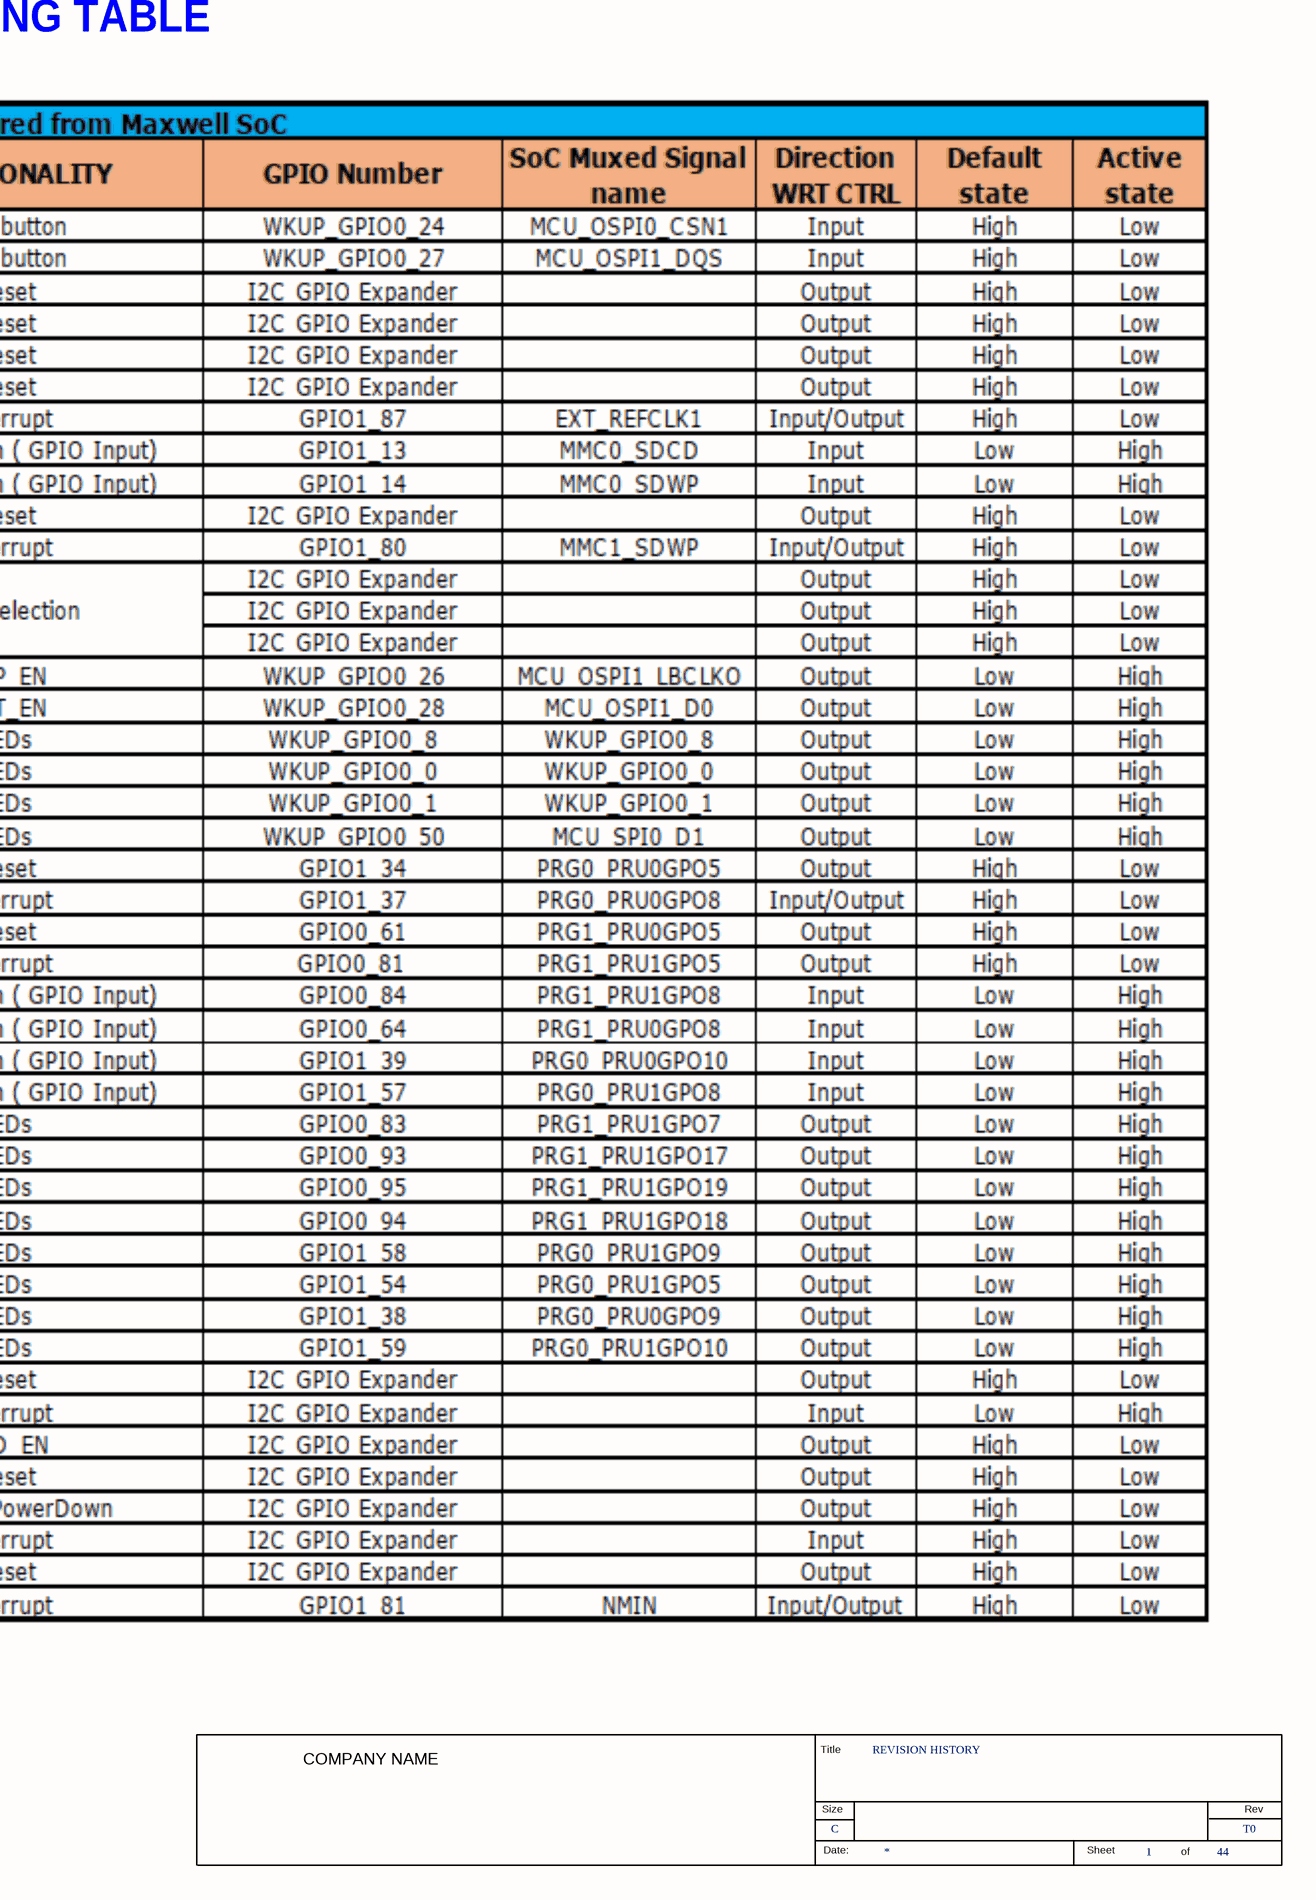
[diagram p8: 07-GPIO MAPPING TABLE.SchDoc, right]

### Parts
(Parts that share a designator on the sheet are numbered #1, #2 ... from top to bottom, then left to right.)
*#7  RevCode: T0  Title: REVISION HISTORY  Page Size: C  Page Number: 1  Page Count: 44  (hidden comment: TRAINING_TITLEBLK_CSIZE)  (graphical)

### Notes on the sheet
- GPIO  MAPPING TABLE
- (in symbol TRAINING_TITLEBLK_CSIZE) Title; COMPANY NAME; Size; Rev; Date:; Sheet; of

### Library data of the parts
*#7 = TRAINING_TITLEBLK_CSIZE: Issue: 1.0; Page Create Date: Jan  8, 2022; Page Modify Date: *

## Sheet 08-I2C TREE.SchDoc
size 513 x 386 mm
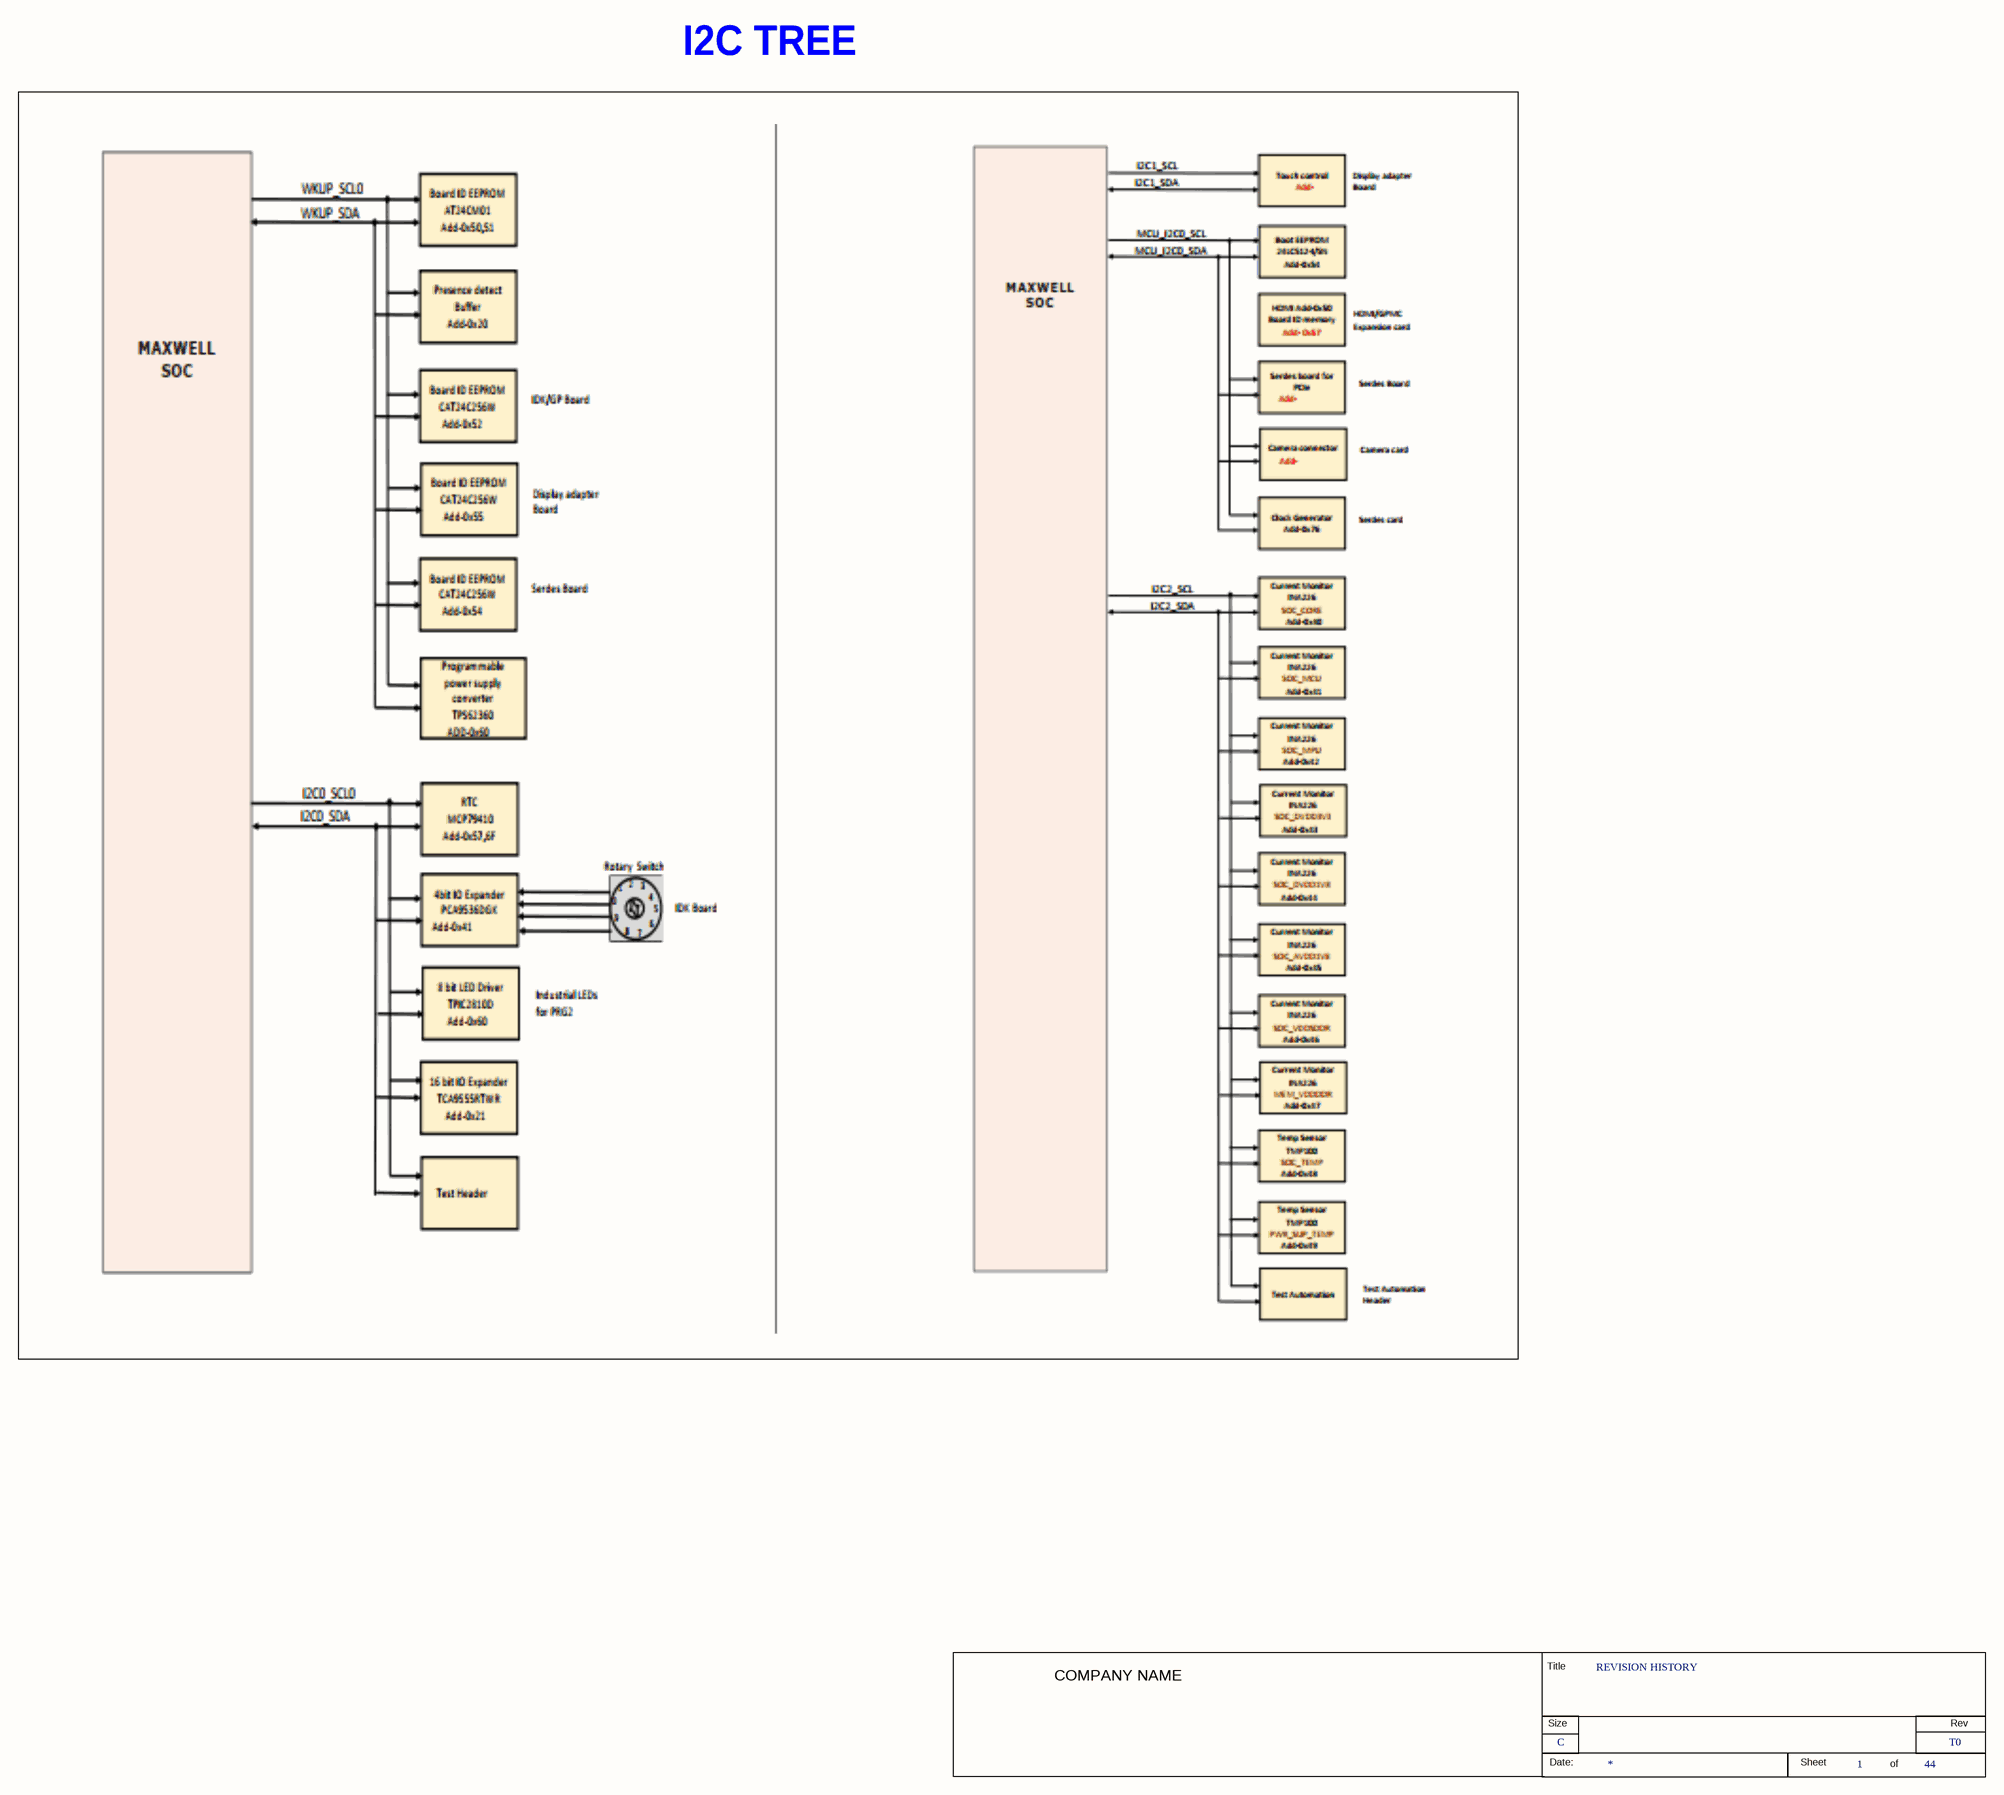
[diagram p9: 08-I2C TREE.SchDoc]

### Parts
(Parts that share a designator on the sheet are numbered #1, #2 ... from top to bottom, then left to right.)
*#8  RevCode: T0  Title: REVISION HISTORY  Page Size: C  Page Number: 1  Page Count: 44  (hidden comment: TRAINING_TITLEBLK_CSIZE)  (graphical)

### Notes on the sheet
- I2C TREE
- (in symbol TRAINING_TITLEBLK_CSIZE) Title; COMPANY NAME; Size; Rev; Date:; Sheet; of

### Library data of the parts
*#8 = TRAINING_TITLEBLK_CSIZE: Issue: 1.0; Page Create Date: Jan  8, 2022; Page Modify Date: *

## Sheet 09-SPI TREE.SchDoc
size 513 x 386 mm
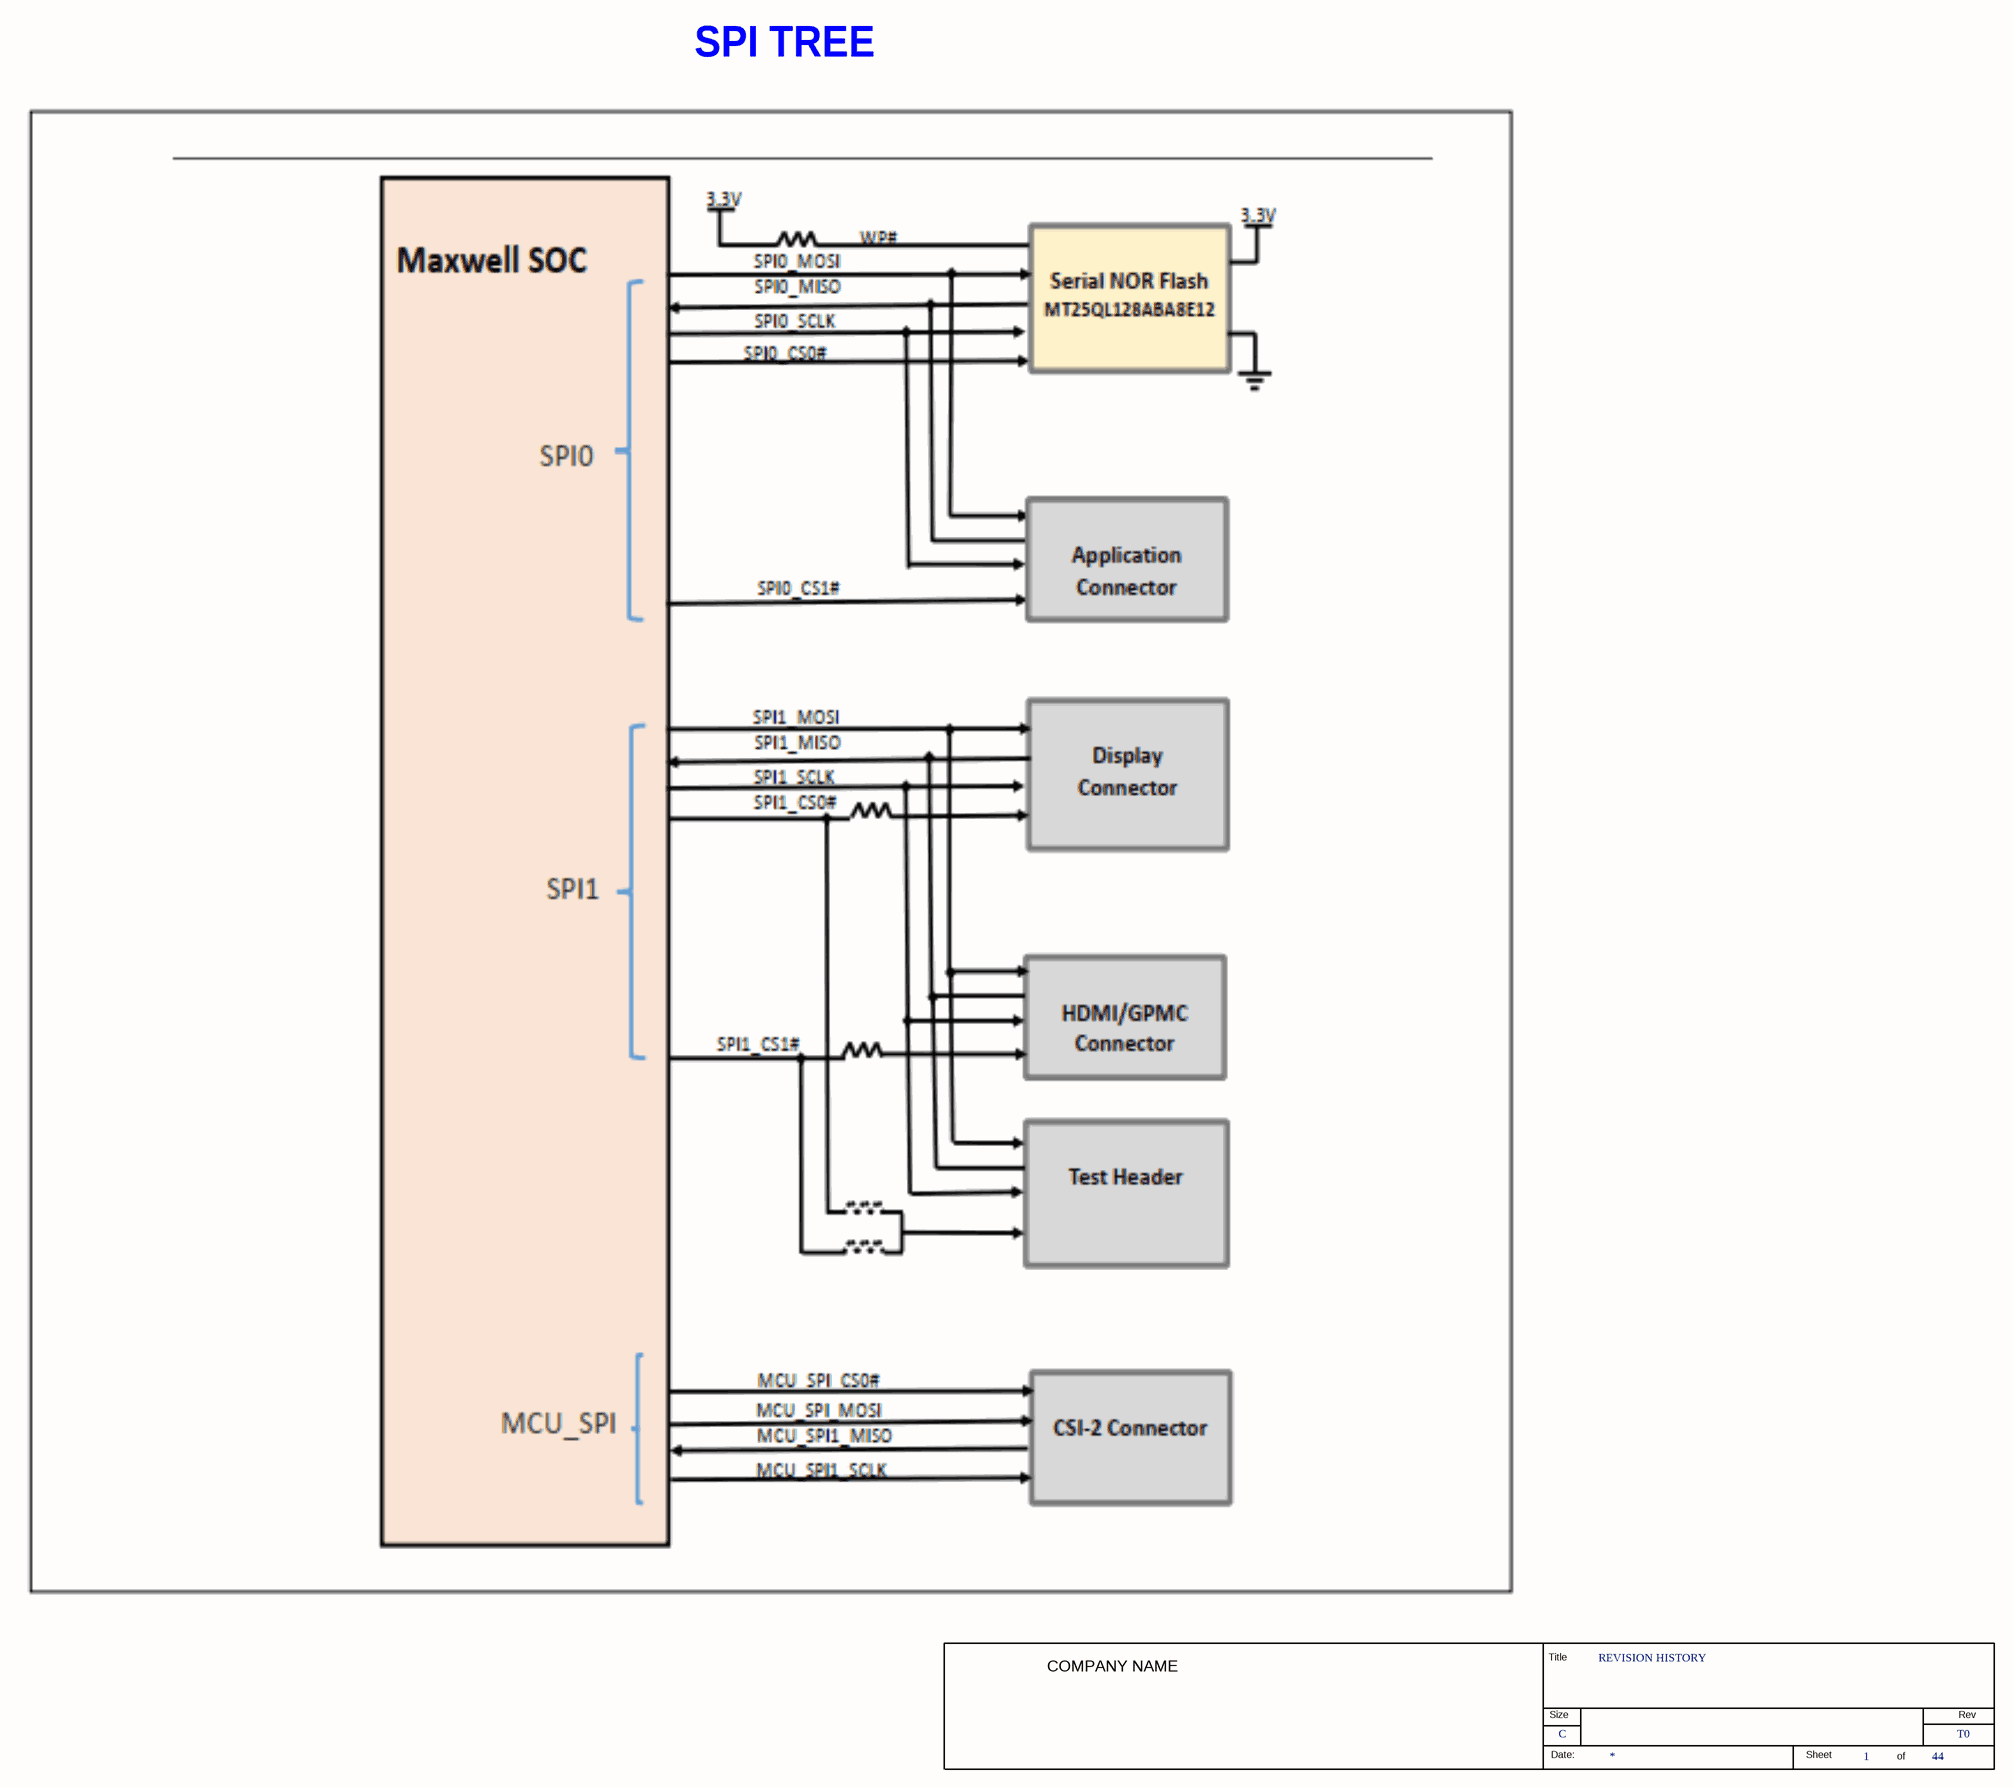
[diagram p10: 09-SPI TREE.SchDoc]

### Parts
(Parts that share a designator on the sheet are numbered #1, #2 ... from top to bottom, then left to right.)
*#9  RevCode: T0  Title: REVISION HISTORY  Page Size: C  Page Number: 1  Page Count: 44  (hidden comment: TRAINING_TITLEBLK_CSIZE)  (graphical)

### Notes on the sheet
- SPI TREE
- (in symbol TRAINING_TITLEBLK_CSIZE) Title; COMPANY NAME; Size; Rev; Date:; Sheet; of

### Library data of the parts
*#9 = TRAINING_TITLEBLK_CSIZE: Issue: 1.0; Page Create Date: Jan  8, 2022; Page Modify Date: *

## Sheet 10-SoC CLOCK AND RESET.SchDoc
size 513 x 386 mm
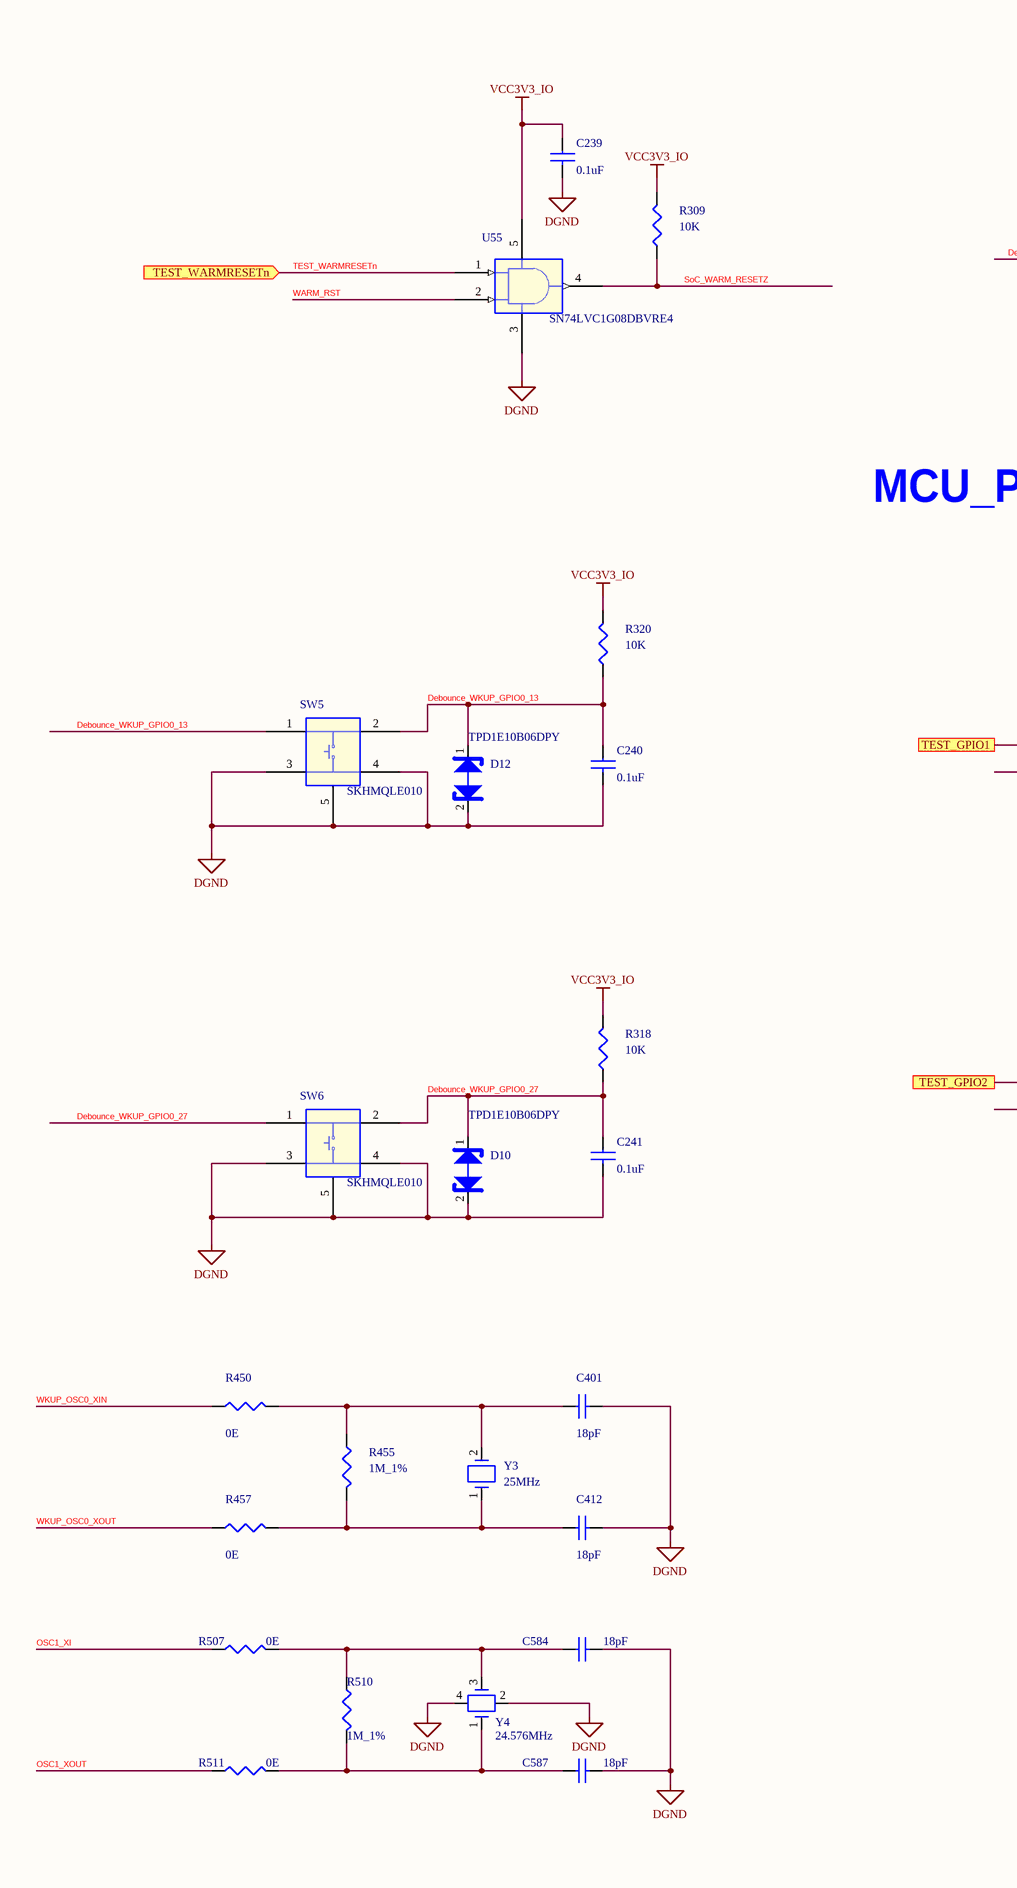
[diagram p11: 10-SoC CLOCK AND RESET.SchDoc, left]
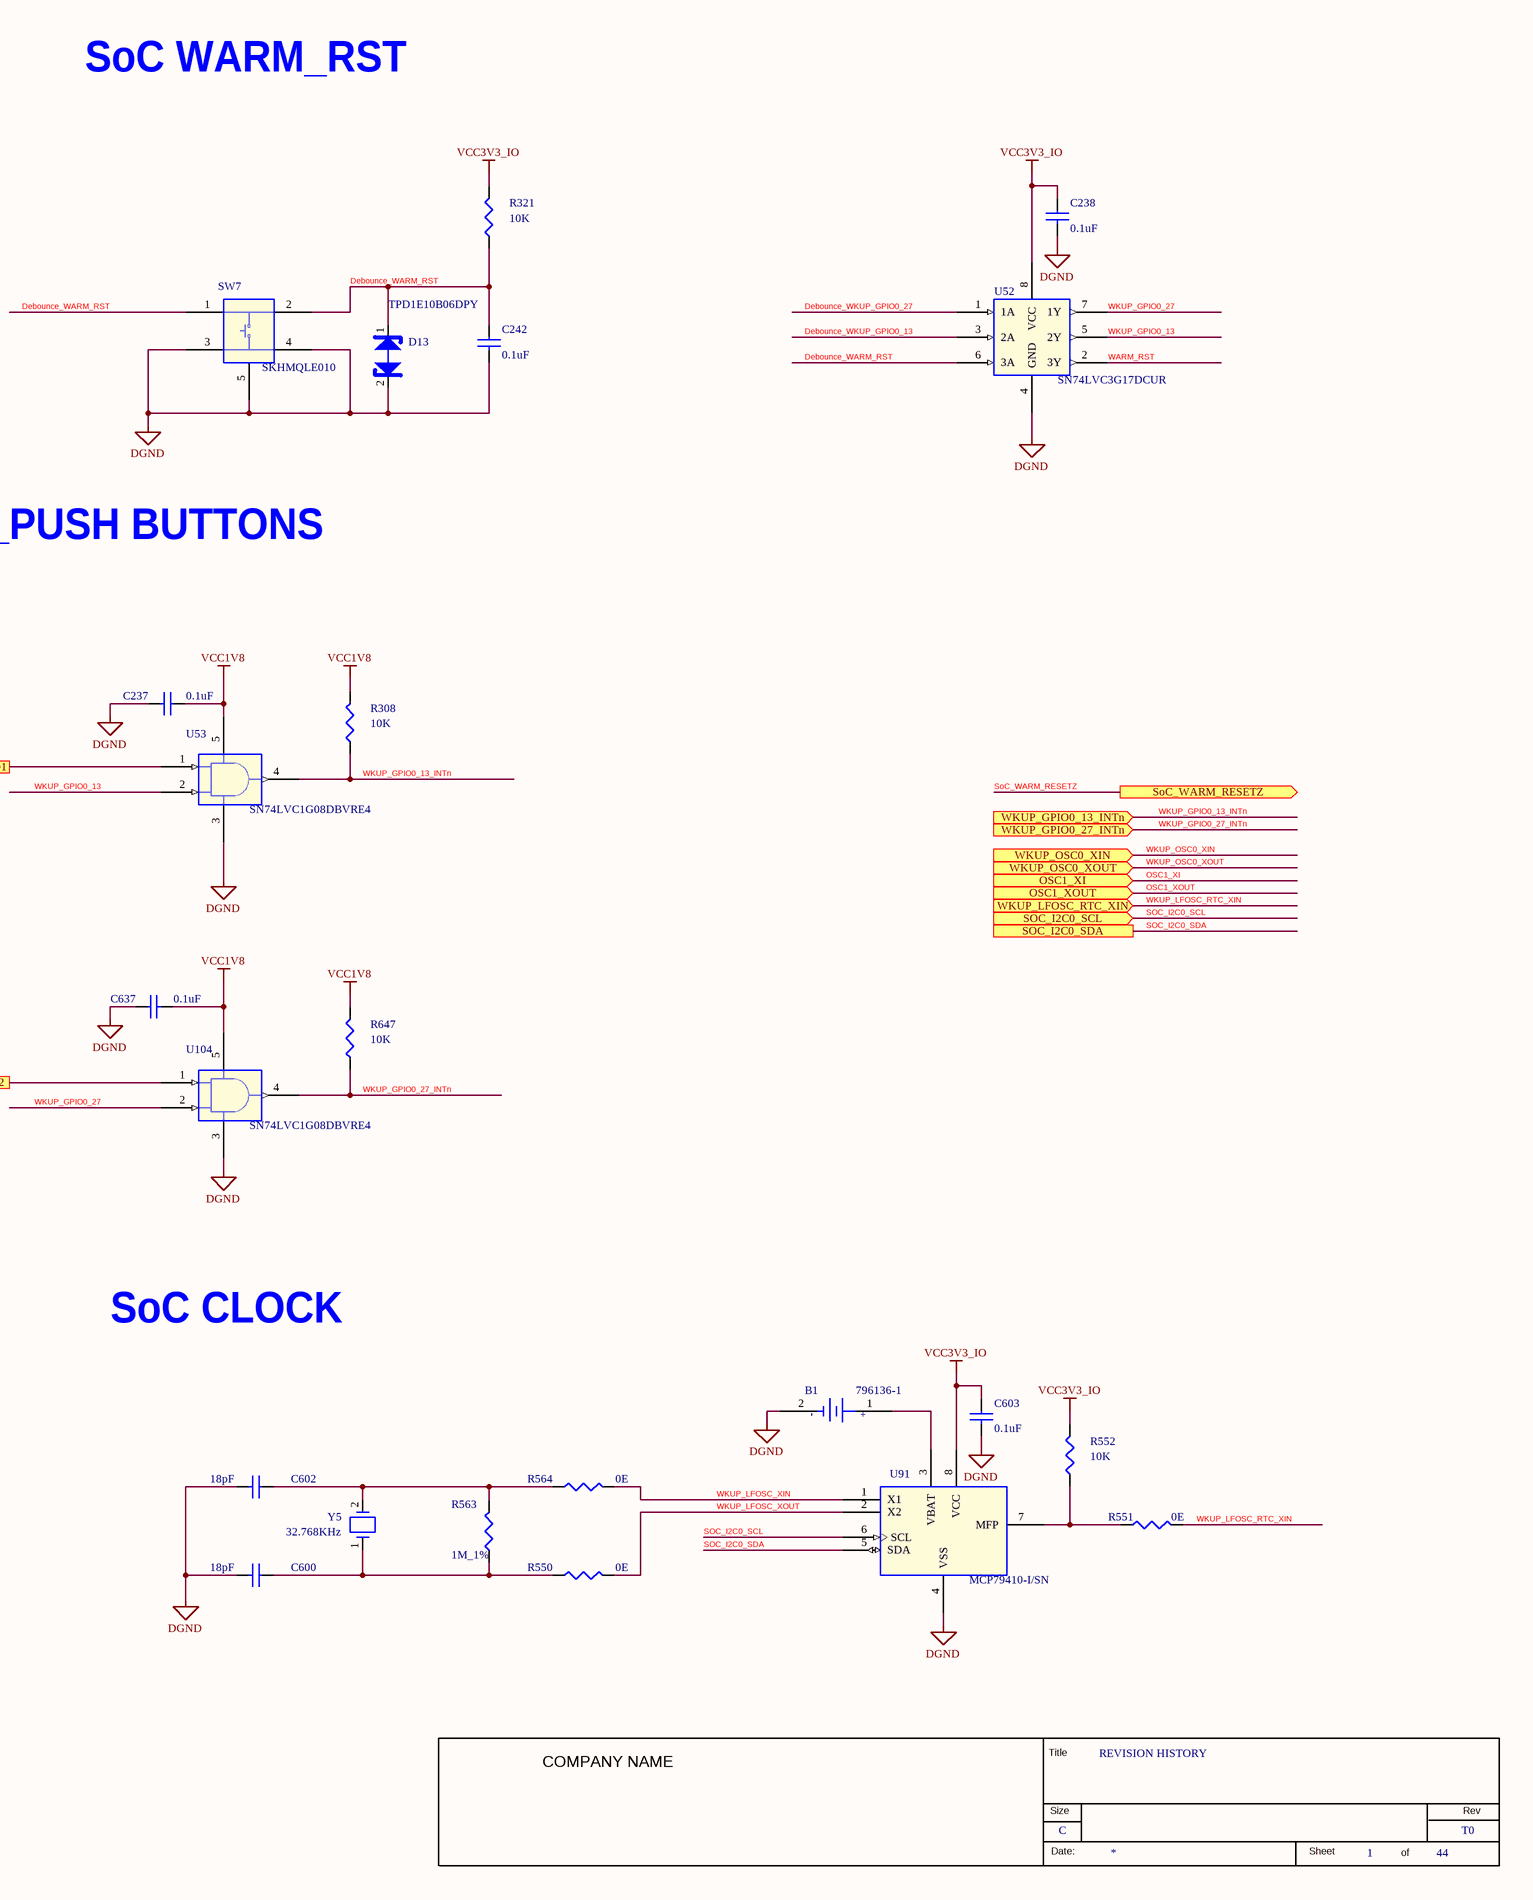
[diagram p12: 10-SoC CLOCK AND RESET.SchDoc, right]

### Parts
(Parts that share a designator on the sheet are numbered #1, #2 ... from top to bottom, then left to right.)
*#10  RevCode: T0  Title: REVISION HISTORY  Page Size: C  Page Number: 1  Page Count: 44  (hidden comment: TRAINING_TITLEBLK_CSIZE)  (graphical)
B1  796136-1  [BATTH2_796136_1080X750_SMD_6-9]
C237  0.1uF  [CAP0201_0-5]
C238  0.1uF  [CAP0201_0-5]
C239  0.1uF  [CAP0201_0-5]
C240  0.1uF  [CAP0201_0-5]
C241  0.1uF  [CAP0201_0-5]
C242  0.1uF  [CAP0201_0-5]
C401  18pF  [CAP0402_0-75]
C412  18pF  [CAP0402_0-75]
C584  18pF  [CAP0402_0-75]
C587  18pF  [CAP0402_0-75]
C600  18pF  [CAP0402_0-75]
C602  18pF  [CAP0402_0-75]
C603  0.1uF  [CAP0201_0-5]
C637  0.1uF  [CAP0201_0-5]
D10  TPD1E10B06DPY  [DIO_DFN0402]
D12  TPD1E10B06DPY  [DIO_DFN0402]
D13  TPD1E10B06DPY  [DIO_DFN0402]
R308  10K  [RES0402_0-5]
R309  10K  [RES0402_0-5]
R318  10K  [RES0402_0-5]
R320  10K  [RES0402_0-5]
R321  10K  [RES0402_0-5]
R450  0E  [RES0402_0-5]
R455  1M_1%  [RES0402]
R457  0E  [RES0402_0-5]
R507  0E  [RES0402_0-5]
R510  1M_1%  [RES0402]
R511  0E  [RES0402_0-5]
R550  0E  [RES0402_0-5]
R551  0E  [RES0402_0-5]
R552  10K  [RES0402_0-5]
R563  1M_1%  [RES0402]
R564  0E  [RES0402_0-5]
R647  10K  [RES0402_0-5]
SW5  SKHMQLE010  [SW4_SKHMQLE010_240X260_SMD_3-1]
SW6  SKHMQLE010  [SW4_SKHMQLE010_240X260_SMD_3-1]
SW7  SKHMQLE010  [SW4_SKHMQLE010_240X260_SMD_3-1]
U52  SN74LVC3G17DCUR  [VSSOP8_19-68_85X95_0-9]
U53  SN74LVC1G08DBVRE4  [SOT23-5]
U55  SN74LVC1G08DBVRE4  [SOT23-5]
U91  MCP79410-I/SN  [SOIC8_1-8]
U104  SN74LVC1G08DBVRE4  [SOT23-5]
Y3  25MHz  [XTAL_ABM3_210X130_SMD]
Y4  24.576MHz  [XTAL4_TXC_130X100_SMD_0-8]
Y5  32.768KHz  [XTAL_ABS07_130X60_SMD_0-9]

### Ports
OSC1_XI (in), OSC1_XOUT (in), SOC_I2C0_SCL (in), SOC_I2C0_SDA, SoC_WARM_RESETZ (out), TEST_GPIO1, TEST_GPIO2, TEST_WARMRESETn (in), WKUP_GPIO0_13_INTn (in), WKUP_GPIO0_27_INTn (in), WKUP_LFOSC_RTC_XIN (in), WKUP_OSC0_XIN (in), WKUP_OSC0_XOUT (in)

### Nets
DGND: B1.2(-) C237.2 C238.2 C239.2 C240.2 C241.2 C242.2 C401.2 C412.2 C584.2 C587.2 C600.2 C602.2 C603.2 C637.1 D10.2(A) D12.2(A) D13.2(A) SW5.3 SW5.4 SW5.5(GND) SW6.3 SW6.4 SW6.5(GND) SW7.3 SW7.4 SW7.5(GND) U52.4(GND) U53.3(GND) U55.3(GND) U91.4(VSS) U104.3(GND) Y4.2 Y4.4
VCC1V8: C237.1 C637.2 R308.2 R647.2 U53.5(VCC) U104.5(VCC)
VCC3V3_IO: C238.1 C239.1 C603.1 R309.2 R318.2 R320.2 R321.2 R552.2 U52.8(VCC) U55.5(VCC) U91.8(VCC)
Debounce_WARM_RST: C242.1 D13.1(K) R321.1 SW7.1 SW7.2 U52.6(3A)
Debounce_WKUP_GPIO0_13: C240.1 D12.1(K) R320.1 SW5.1 SW5.2 U52.3(2A)
Debounce_WKUP_GPIO0_27: C241.1 D10.1(K) R318.1 SW6.1 SW6.2 U52.1(1A)
OSC1_XI: R507.1 ; port OSC1_XI
OSC1_XOUT: R511.1 ; port OSC1_XOUT
SOC_I2C0_SCL: U91.6(SCL) ; port SOC_I2C0_SCL
SOC_I2C0_SDA: U91.5(SDA) ; port SOC_I2C0_SDA
SoC_WARM_RESETZ: R309.1 U55.4(Y) ; port SoC_WARM_RESETZ
TEST_GPIO1: U53.1(A) ; port TEST_GPIO1
TEST_GPIO2: U104.1(A) ; port TEST_GPIO2
TEST_WARMRESETn: U55.1(A) ; port TEST_WARMRESETn
WARM_RST: U52.2(3Y) U55.2(B)
WKUP_GPIO0_13: U52.5(2Y) U53.2(B)
WKUP_GPIO0_13_INTn: R308.1 U53.4(Y) ; port WKUP_GPIO0_13_INTn
WKUP_GPIO0_27: U52.7(1Y) U104.2(B)
WKUP_GPIO0_27_INTn: R647.1 U104.4(Y) ; port WKUP_GPIO0_27_INTn
WKUP_LFOSC_RTC_XIN: R551.2 ; port WKUP_LFOSC_RTC_XIN
WKUP_LFOSC_XIN: R564.1 U91.1(X1)
WKUP_LFOSC_XOUT: R550.1 U91.2(X2)
WKUP_OSC0_XIN: R450.1 ; port WKUP_OSC0_XIN
WKUP_OSC0_XOUT: R457.1 ; port WKUP_OSC0_XOUT
NetB1_1: B1.1(+) U91.3(VBAT)
NetC401_1: C401.1 R450.2 R455.1 Y3.2
NetC412_1: C412.1 R455.2 R457.2 Y3.1
NetC584_1: C584.1 R507.2 R510.1 Y4.3
NetC587_1: C587.1 R510.2 R511.2 Y4.1
NetC600_1: C600.1 R550.2 R563.2 Y5.1
NetC602_1: C602.1 R563.1 R564.2 Y5.2
NetR551_1: R551.1 R552.1 U91.7(MFP)

### Notes on the sheet
- SoC WARM_RST
- MCU_PUSH BUTTONS
- SoC CLOCK
- (in symbol TRAINING_TITLEBLK_CSIZE) Title; COMPANY NAME; Size; Rev; Date:; Sheet; of

### Library data of the parts
*#10 = TRAINING_TITLEBLK_CSIZE: Issue: 1.0; Page Create Date: Jan  8, 2022; Page Modify Date: *
B1 = BATTERY: BATTERY HOLDER COIN CELL TOP LOAD SMD; Mfr_name: AMP INCORPORATED; Mistral Part No: 130011020020-R; Wattage: NA; Project: OMAPL1_PEC20; Library Ref: BATTERY; Chkd/date: MANIRAJA/161017; Crtd /date: BAVISH/090211; Datasheet: Y:\MIS_DATABASE\DATASHEETS\MISC\BATTERY\796136-1.PDF; Temperature: NA; Weight: NA; Height: 6.85MM; Distributor_part_number: A99327CT-ND; Distributor_name: DIGIKEY; Package: SMD; Voltage: NA; Tolerance: NA; Part_type: BATTERY HOLDER; Mfr_part_number: 796136-1; MECHANICAL 3D STEP FILE: BATTH2_796136_1080X750_SMD_6-9; PCB Footprint: BATTH2_796136_1080X750_SMD_6-9
C237-C239 C242 = CAP_Dup5: CAP CERAMIC 0.1uF 16V 10% X5R 0201; Part_type: CAPACITORS\CERAMIC; Mfr_part_number: GRM033R61C104KE84J; Mfr_name: MURATA; Mistral Part No: 120009030072-R; Custom_Duty: 15%; Customs_HS_Code: 85322990; Wattage: NA; Project: TI_MAXIE_CPB; Library Ref: CAP; MECHANICAL 3D STEP FILE: CAP0201_0-5; Chkd/date: MANIRAJA/120218; Crtd /date: MANIRAJA/120218; Datasheet: Y:\MIS_DATABASE\DATASHEETS\CAPACITORS\GRM033R61C104KE84.PDF; Temperature: -55°C+85°C; Weight: 0.33mg; Height: 0.33MM; Distributor_part_number: 490-16742-1-ND; Distributor_name: DIGIKEY; Package: 0201; Voltage: 16V; Tolerance: 10%; PCB Footprint: CAP0201_0-5
C240 C241 C603 C637 = CAP_Dup5: CAP CERAMIC 0.1uF 16V 10% X5R 0201; Mistral Part No: 120009030072-R; Mfr_name: MURATA; Mfr_part_number: GRM033R61C104KE84J; Part_type: CAPACITORS\CERAMIC; Project: TI_MAXIE_CPB; Wattage: NA; Customs_HS_Code: 85322990; Custom_Duty: 15%; Library Ref: CAP; Tolerance: 10%; Voltage: 16V; Package: 0201; Distributor_name: DIGIKEY; Distributor_part_number: 490-16742-1-ND; Height: 0.33MM; Weight: 0.33mg; Temperature: -55°C+85°C; Datasheet: Y:\MIS_DATABASE\DATASHEETS\CAPACITORS\GRM033R61C104KE84.PDF; Crtd /date: MANIRAJA/120218; Chkd/date: MANIRAJA/120218; MECHANICAL 3D STEP FILE: CAP0201_0-5; PCB Footprint: CAP0201_0-5
C401 C412 C584 C587 C602 = CAP_Dup5: CAP CERAMIC 18pF 50V 5% C0G(NP0) 0402; Part_type: CAPACITORS\CERAMIC; Mfr_part_number: GRM1555C1H180JA01D; Mfr_name: MURATA; Mistral Part No: 120014050002-R; Custom_Duty: 15%; Customs_HS_Code: 85322990; Wattage: NA; Project: HUMANWARE_PHOENIX; Footprint Path: Y:\MIS_DATABASE\Library\ALTIUM_TOOL\PCB_FOOTPRINTS\Altium_Footprint_Lib.PcbLib; Library Path: Y:\MIS_DATABASE\Library\ALTIUM_TOOL\SCHEMATICS_PARTS\MS_DISCRETE_Library.schlib; MECHANICAL 3D STEP FILE: CAP0402_0-75; PCB Footprint: CAP0402_0-75; Footprint Ref: CAP0402_0-75; Library Ref: CAP; Chkd/date: VASANTHA/150514; Crtd /date: BALACHANDAR/150514; Datasheet: Y:\MIS_DATABASE\DATASHEETS\CAPACITORS\GRM188SERIES.PDF; Temperature: -55°C+125°C; Weight: 6mg; Height: 0.55MM; Distributor_part_number: 490-5858-1-ND; Distributor_name: DIGIKEY; Package: 0402; Voltage: 50V; Tolerance: 5%
C600 = CAP_Dup5: CAP CERAMIC 18pF 50V 5% C0G(NP0) 0402; Mistral Part No: 120014050002-R; Mfr_name: MURATA; Mfr_part_number: GRM1555C1H180JA01D; Part_type: CAPACITORS\CERAMIC; Project: HUMANWARE_PHOENIX; Wattage: NA; Customs_HS_Code: 85322990; Custom_Duty: 15%; Footprint Path: Y:\MIS_DATABASE\Library\ALTIUM_TOOL\PCB_FOOTPRINTS\Altium_Footprint_Lib.PcbLib; Library Path: Y:\MIS_DATABASE\Library\ALTIUM_TOOL\SCHEMATICS_PARTS\MS_DISCRETE_Library.schlib; MECHANICAL 3D STEP FILE: CAP0402_0-75; PCB Footprint: CAP0402_0-75; Footprint Ref: CAP0402_0-75; Library Ref: CAP; Tolerance: 5%; Voltage: 50V; Package: 0402; Distributor_name: DIGIKEY; Distributor_part_number: 490-5858-1-ND; Height: 0.55MM; Weight: 6mg; Temperature: -55°C+125°C; Datasheet: Y:\MIS_DATABASE\DATASHEETS\CAPACITORS\GRM188SERIES.PDF; Crtd /date: BALACHANDAR/150514; Chkd/date: VASANTHA/150514
D10 D12 = DIODE_PESD: DIODE 1CH ESD PROTECTION SMD(0402); Mistral Part No: 130014110022-R; Mfr_name: TEXAS INSTRUMENTS; Part_type: DIODE\MISC; Project: GALILEO_EVM; Tolerance: NA; Customs_HS_Code: 85423100; Custom_Duty: 15%; Library Ref: DIODE_PESD; Mfr_part_number: TPD1E10B06DPY; Voltage: NA; Wattage: NA; Package: SMD; Distributor_name: DIGIKEY; Distributor_part_number: 296-30406-1-ND; Height: 0.45MM; Weight: NA; Temperature: -40°C+125°C; Datasheet: Y:\MIS_DATABASE\DATASHEETS\ICS\INTERFACE\TPD1E10B06.PDF; Crtd /date: VASANTHA/181114; Chkd/date: USMAN/021214; PCB Footprint: DIO_DFN0402
D13 = DIODE_PESD: DIODE 1CH ESD PROTECTION SMD(0402); Part_type: DIODE\MISC; Mfr_name: TEXAS INSTRUMENTS; Mistral Part No: 130014110022-R; Custom_Duty: 15%; Customs_HS_Code: 85423100; Wattage: NA; Project: GALILEO_EVM; Library Ref: DIODE_PESD; Chkd/date: USMAN/021214; Crtd /date: VASANTHA/181114; Datasheet: Y:\MIS_DATABASE\DATASHEETS\ICS\INTERFACE\TPD1E10B06.PDF; Temperature: -40°C+125°C; Weight: NA; Height: 0.45MM; Distributor_part_number: 296-30406-1-ND; Distributor_name: DIGIKEY; Package: SMD; Voltage: NA; Tolerance: NA; Mfr_part_number: TPD1E10B06DPY; PCB Footprint: DIO_DFN0402
R308 R647 = RESISTOR_Dup5: RES 10K 1/16W 5% 0402; Mistral Part No: 110009030208-R; Mfr_name: YAGEO AMERICA; Mfr_part_number: RC0402JR-0710KL; Part_type: RESISTORS\FIXED; Project: HSE; Voltage: NA; Customs_HS_Code: 85332119; Custom_Duty: 15%; Footprint Path: Y:\MIS_DATABASE\Library\ALTIUM_TOOL\PCB_FOOTPRINTS\Altium_Footprint_Lib.PcbLib; Library Path: Y:\MIS_DATABASE\Library\ALTIUM_TOOL\SCHEMATICS_PARTS\MS_DISCRETE_Library.schlib; Footprint Ref: RES0402_0-5; Library Ref: RESISTOR; Tolerance: 5%; Wattage: 1/16W; Package: 0402; Distributor_name: DIGIKEY; Distributor_part_number: 311-10KJRCT-ND; Height: 0.40MM; Weight: 0.65mg; Temperature: -55°C+155°C; Datasheet: Y:\MIS_DATABASE\DATASHEETS\RESISTORS\YAGEO-RC0402.PDF; Crtd /date: MAZHAR/230805; Chkd/date: VASANTHA/061216; RoHS: Pb-Free; MECHANICAL 3D STEP FILE: RES0402_0-5; PCB Footprint: RES0402_0-5
R309 R318 R320 R321 R552 = RESISTOR_Dup5: RES 10K 1/16W 5% 0402; Part_type: RESISTORS\FIXED; Mfr_part_number: RC0402JR-0710KL; Mfr_name: YAGEO AMERICA; Mistral Part No: 110009030208-R; Custom_Duty: 15%; Customs_HS_Code: 85332119; Voltage: NA; Project: HSE; Footprint Path: Y:\MIS_DATABASE\Library\ALTIUM_TOOL\PCB_FOOTPRINTS\Altium_Footprint_Lib.PcbLib; Library Path: Y:\MIS_DATABASE\Library\ALTIUM_TOOL\SCHEMATICS_PARTS\MS_DISCRETE_Library.schlib; Footprint Ref: RES0402_0-5; Library Ref: RESISTOR; MECHANICAL 3D STEP FILE: RES0402_0-5; RoHS: Pb-Free; Chkd/date: VASANTHA/061216; Crtd /date: MAZHAR/230805; Datasheet: Y:\MIS_DATABASE\DATASHEETS\RESISTORS\YAGEO-RC0402.PDF; Temperature: -55°C+155°C; Weight: 0.65mg; Height: 0.40MM; Distributor_part_number: 311-10KJRCT-ND; Distributor_name: DIGIKEY; Package: 0402; Wattage: 1/16W; Tolerance: 5%; PCB Footprint: RES0402_0-5
R450 R457 R507 R511 R564 = RESISTOR_Dup4: RES 0E 1/16W 0402; Part_type: RESISTORS\FIXED; Mfr_part_number: CRCW04020000Z0ED; Mfr_name: VISHAY; Mistral Part No: 110010080019-P; Custom_Duty: 15%; Customs_HS_Code: 85332119; Voltage: NA; Project: PB_BUGBASE; Footprint Path: Y:\MIS_DATABASE\Library\ALTIUM_TOOL\PCB_FOOTPRINTS\Altium_Footprint_Lib.PcbLib; Library Path: Y:\MIS_DATABASE\Library\ALTIUM_TOOL\SCHEMATICS_PARTS\MS_DISCRETE_Library.schlib; Footprint Ref: RES0402_0-5; Library Ref: RESISTOR; RoHS: Pb-Free; Chkd/date: VASANTHA/201216; Crtd /date: MUDDU/190810; Datasheet: Y:\MIS_DATABASE\DATASHEETS\RESISTORS\CRCW0603.PDF; Temperature: -55°C+155°C; Weight: 0.65g/1000pcs; Height: 0.40MM; Distributor_part_number: 541-0.0JCT-ND; Distributor_name: DIGIKEY; Package: 0402; Wattage: 1/16W; Tolerance: NA; MECHANICAL 3D STEP FILE: RES0402_0-5; PCB Footprint: RES0402_0-5
R455 = RESISTOR_Dup5: RES 1M 1/16W 1% 0402; Part_type: RESISTORS\FIXED; Mfr_part_number: RMCF0402FT1M00; Mfr_name: STACKPOLE ELECTRONICS; Mistral Part No: 110014060045-R; Custom_Duty: 15%; Customs_HS_Code: 85332119; Voltage: NA; Project: AEGIS_POM; NI_MARK: DNI; Footprint Path: Y:\MIS_DATABASE\Library\ALTIUM_TOOL\PCB_FOOTPRINTS\Altium_Footprint_Lib.PcbLib; Library Path: Y:\MIS_DATABASE\Library\ALTIUM_TOOL\SCHEMATICS_PARTS\MS_DISCRETE_Library.schlib; Footprint Ref: RES0402; Library Ref: RESISTOR; Chkd/date: VASANTHA/200614; Crtd /date: NAVEED/170614; Datasheet: Y:\MIS_DATABASE\DATASHEETS\RESISTORS\RMCF-SERIES1.PDF; Temperature: -55°C+155°C; Weight: 0.57mg; Height: 0.40MM; Distributor_part_number: RMCF0402FT1M00CT-ND; Distributor_name: DIGIKEY; Package: 0402; Wattage: 1/16W; Tolerance: 1%; PCB Footprint: RES0402
R510 R563 = RESISTOR_Dup5: RES 1M 1/16W 1% 0402; Mistral Part No: 110014060045-R; Mfr_name: STACKPOLE ELECTRONICS; Mfr_part_number: RMCF0402FT1M00; Part_type: RESISTORS\FIXED; Project: AEGIS_POM; Voltage: NA; Customs_HS_Code: 85332119; Custom_Duty: 15%; NI_MARK: DNI; Footprint Path: Y:\MIS_DATABASE\Library\ALTIUM_TOOL\PCB_FOOTPRINTS\Altium_Footprint_Lib.PcbLib; Library Path: Y:\MIS_DATABASE\Library\ALTIUM_TOOL\SCHEMATICS_PARTS\MS_DISCRETE_Library.schlib; Footprint Ref: RES0402; Library Ref: RESISTOR; Tolerance: 1%; Wattage: 1/16W; Package: 0402; Distributor_name: DIGIKEY; Distributor_part_number: RMCF0402FT1M00CT-ND; Height: 0.40MM; Weight: 0.57mg; Temperature: -55°C+155°C; Datasheet: Y:\MIS_DATABASE\DATASHEETS\RESISTORS\RMCF-SERIES1.PDF; Crtd /date: NAVEED/170614; Chkd/date: VASANTHA/200614; PCB Footprint: RES0402
R550 R551 = RESISTOR_Dup4: RES 0E 1/16W 0402; Mistral Part No: 110010080019-P; Mfr_name: VISHAY; Mfr_part_number: CRCW04020000Z0ED; Part_type: RESISTORS\FIXED; Project: PB_BUGBASE; Tolerance: NA; Customs_HS_Code: 85332119; Custom_Duty: 15%; Footprint Path: Y:\MIS_DATABASE\Library\ALTIUM_TOOL\PCB_FOOTPRINTS\Altium_Footprint_Lib.PcbLib; Library Path: Y:\MIS_DATABASE\Library\ALTIUM_TOOL\SCHEMATICS_PARTS\MS_DISCRETE_Library.schlib; Footprint Ref: RES0402_0-5; Library Ref: RESISTOR; PCB Footprint: RES0402_0-5; MECHANICAL 3D STEP FILE: RES0402_0-5; Voltage: NA; Wattage: 1/16W; Package: 0402; Distributor_name: DIGIKEY; Distributor_part_number: 541-0.0JCT-ND; Height: 0.40MM; Weight: 0.65g/1000pcs; Temperature: -55°C+155°C; Datasheet: Y:\MIS_DATABASE\DATASHEETS\RESISTORS\CRCW0603.PDF; Crtd /date: MUDDU/190810; Chkd/date: VASANTHA/201216; RoHS: Pb-Free
SW5 SW7 = SW4_SKHUPLE010: SWITCH TACTILE SPST ST SMD; Part_type: ELECTRO-MECHANICAL\SWITCH; Mfr_name: ALPS; Mistral Part No: 130017100007-R; Custom_Duty: 24%; Customs_HS_Code: 85369090; Wattage: NA; Project: TI_MAXIE_CPB; Library Ref: SW4_SKHUPLE010; MECHANICAL 3D STEP FILE: SW4_SKHMQLE010_240X260_SMD_3-1; Chkd/date: MANIRAJA/051017; Crtd /date: MANIRAJA/051017; Datasheet: Y:\MIS_DATABASE\DATASHEETS\MISC\SWITCHES\SKHMQLE010.PDF; Temperature: -30°C+85°C; Weight: NA; Height: 3.10MM; Distributor_part_number: 688-SKHMQLE010; Distributor_name: MOUSER; Package: SMD; Voltage: NA; Tolerance: NA; Mfr_part_number: SKHMQLE010; PCB Footprint: SW4_SKHMQLE010_240X260_SMD_3-1
SW6 = SW4_SKHUPLE010: SWITCH TACTILE SPST ST SMD; Mistral Part No: 130017100007-R; Mfr_name: ALPS; Part_type: ELECTRO-MECHANICAL\SWITCH; Project: TI_MAXIE_CPB; Tolerance: NA; Customs_HS_Code: 85369090; Custom_Duty: 24%; Library Ref: SW4_SKHUPLE010; Mfr_part_number: SKHMQLE010; Voltage: NA; Wattage: NA; Package: SMD; Distributor_name: MOUSER; Distributor_part_number: 688-SKHMQLE010; Height: 3.10MM; Weight: NA; Temperature: -30°C+85°C; Datasheet: Y:\MIS_DATABASE\DATASHEETS\MISC\SWITCHES\SKHMQLE010.PDF; Crtd /date: MANIRAJA/051017; Chkd/date: MANIRAJA/051017; MECHANICAL 3D STEP FILE: SW4_SKHMQLE010_240X260_SMD_3-1; PCB Footprint: SW4_SKHMQLE010_240X260_SMD_3-1
U52 = SN74LVC3G17DCUR_VSSOP8: IC TRIPLE SCHMITT-TRIGGER BUFFER VSSOP8; Mistral Part No: 141017090019-R; Mfr_name: TEXAS INSTRUMENTS; Part_type: ICS\DIGITAL\COMBINATIONAL; Project: TI_MAXIE_CPB; Tolerance: NA; Customs_HS_Code: 85423100; Custom_Duty: 15%; Library Ref: SN74LVC3G17DCUR_VSSOP8; Mfr_part_number: SN74LVC3G17DCUR; Voltage: NA; Wattage: NA; Package: VSSOP8; Distributor_name: DIGIKEY; Distributor_part_number: 296-18818-1-ND; Height: 0.90MM; Weight: 9.6mg; Temperature: -40°C+125°C; Datasheet: Y:\MIS_DATABASE\DATASHEETS\ICS\DIGITAL\COMBINATIONAL\SN74LVC3G17.PDF; Crtd /date: MANIRAJA/280917; Chkd/date: MANIRAJA/280917; MECHANICAL 3D STEP FILE: VSSOP8_19-68_85X95_0-9; PCB Footprint: VSSOP8_19-68_85X95_0-9
U53 U55 U104 = SN74LVC1G08DBVRE4_SOT23-5: IC SINGLE 2-INPUT POSITIVE AND GATE SOT23-5; Part_type: ICS\DIGITAL\GATES; Mfr_name: TEXAS INSTRUMENTS; Mistral Part No: 141009060026-R; Custom_Duty: 15%; Customs_HS_Code: 85423100; Project: KHAN_MAIN; Library Ref: SN74LVC1G08DBVRE4_SOT23-5; RoHS: Sb/ Br FREE; Chkd/date: SUHAS/221010; Crtd /date: USMAN/151008; Datasheet: Y:\MIS_DATABASE\DATASHEETS\ICS\DIGITAL\GATES\SN74LVC1G08.PDF; Temperature: -40°C+85°C; Height: 1.45MM; Distributor_part_number: SN74LVC1G08DBVRE4-ND; Distributor_name: DIGIKEY; Package: SOT23-5; Mfr_part_number: SN74LVC1G08DBVRE4; PCB Footprint: SOT23-5
U91 = MCP79410_SOIC8: IC BATTERY-BACKED I2C RTCC WITH SRAM,EEPROM SOIC8; Part_type: ICS\POWER\BATTERY MANGEMENT; Mfr_name: MICROCHIP; Mistral Part No: 142017060006-R; Custom_Duty: 15%; Customs_HS_Code: 85423100; Wattage: NA; Project: TI_SVB_CONTROLLER CARD; Library Ref: MCP79410_SOIC8; MECHANICAL 3D STEP FILE: SOIC8_1-8; Chkd/date: MANIRAJA/190617; Crtd /date: MANIRAJA/190617; Datasheet: Y:\MIS_DATABASE\DATASHEETS\ICS\POWER\MCP7941XX.PDF; Temperature: -40°C+85°C; Weight: 540mg; Height: 1.75MM; Distributor_part_number: MCP79410-I/SN-ND; Distributor_name: DIGIKEY; Package: SOIC8; Voltage: NA; Tolerance: NA; Mfr_part_number: MCP79410-I/SN; PCB Footprint: SOIC8_1-8
Y3 = CRY: CRY 25MHz SMD; Mistral Part No: 130011100003-R; Mfr_name: CTS; Mfr_part_number: 445I23D25M00000; Part_type: CRYSTAL; Project: VP-4000-PROCESSOR; Tolerance: NA; Customs_HS_Code: 85439000; Custom_Duty: 24%; Library Ref: CRY; Voltage: NA; Wattage: NA; Package: SMD; Distributor_name: DIGIKEY; Distributor_part_number: 535-10645-1-ND; Height: 1.50MM; Weight: NA; Temperature: -40°C+85°C; Datasheet: Y:\MIS_DATABASE\DATASHEETS\MISC\CRY_OSC\ABM3.PDF; Crtd /date: CHAITHANYA/041011; Chkd/date: BAVISH/041011; PCB Footprint: XTAL_ABM3_210X130_SMD
Y4 = CRY4_13: CRY 24.576MHz 18pF SMD; Mistral Part No: 130018010021-R; Mfr_name: TXC CORPORATION; Mfr_part_number: 7M-24.576MAAJ-T; Part_type: CRYSTAL; Project: TI_MAXIE_CPB; Tolerance: NA; Customs_HS_Code: 85439000; Custom_Duty: 24%; Library Ref: CRY4_13; PCB Footprint: XTAL4_TXC_130X100_SMD_0-8; Voltage: NA; Wattage: NA; Package: SMD; Distributor_name: DIGIKEY; Distributor_part_number: 887-2373-1-ND; Height: 0.80MM; Weight: 16mg; Temperature: -20°C+70°C; Datasheet: Y:\MIS_DATABASE\DATASHEETS\MISC\CRY_OSC\7M-SER.PDF; Crtd /date: MANIRAJA/240118; Chkd/date: MANIRAJA/240118; MECHANICAL 3D STEP FILE: XTAL4_TXC_130X100_SMD_0-8
Y5 = CRY: CRY 32.768KHz 12.5pF SMD; Mistral Part No: 130009030082-R; Mfr_name: ABRACON; Mfr_part_number: ABS07-32.768KHZ-T; Part_type: CRYSTAL; Project: SMART VIEW_IP CAMERA; Tolerance: NA; Customs_HS_Code: 85439000; Custom_Duty: 24%; Library Ref: CRY; Voltage: NA; Wattage: NA; Package: SMD; Distributor_name: DIGIKEY; Distributor_part_number: 535-9542-1-ND; Height: 0.90MM; Weight: 16mg; Temperature: -40°C+85°C; Datasheet: Y:\MIS_DATABASE\DATASHEETS\MISC\CRY_OSC\ABS07.PDF; Crtd /date: MAZHAR/250907; Chkd/date: VASANTHA/050117; MECHANICAL 3D STEP FILE: XTAL_ABS07_130X60_SMD_0-9; PCB Footprint: XTAL_ABS07_130X60_SMD_0-9

## Sheet 11-SoC POWER1.SchDoc
size 513 x 386 mm
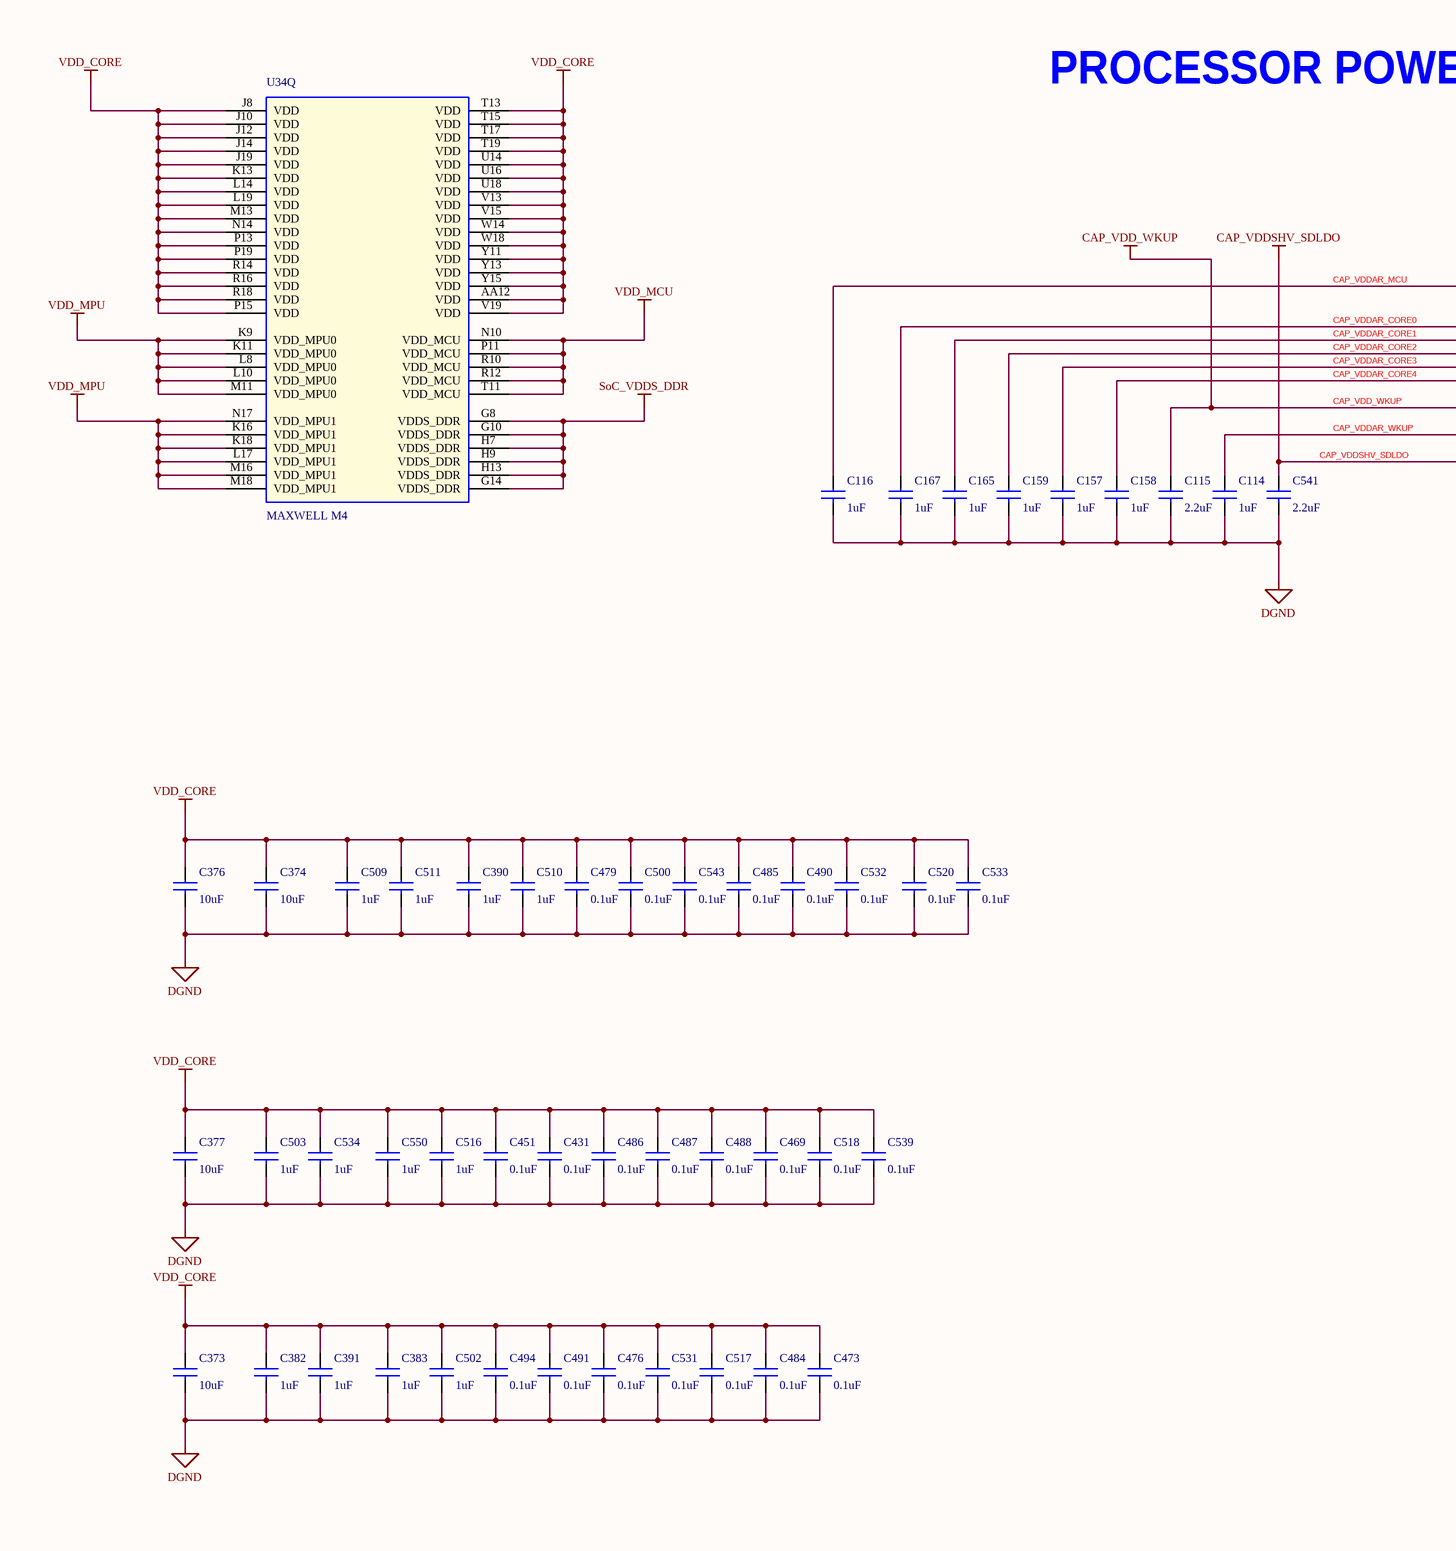
[diagram p13: 11-SoC POWER1.SchDoc, left]
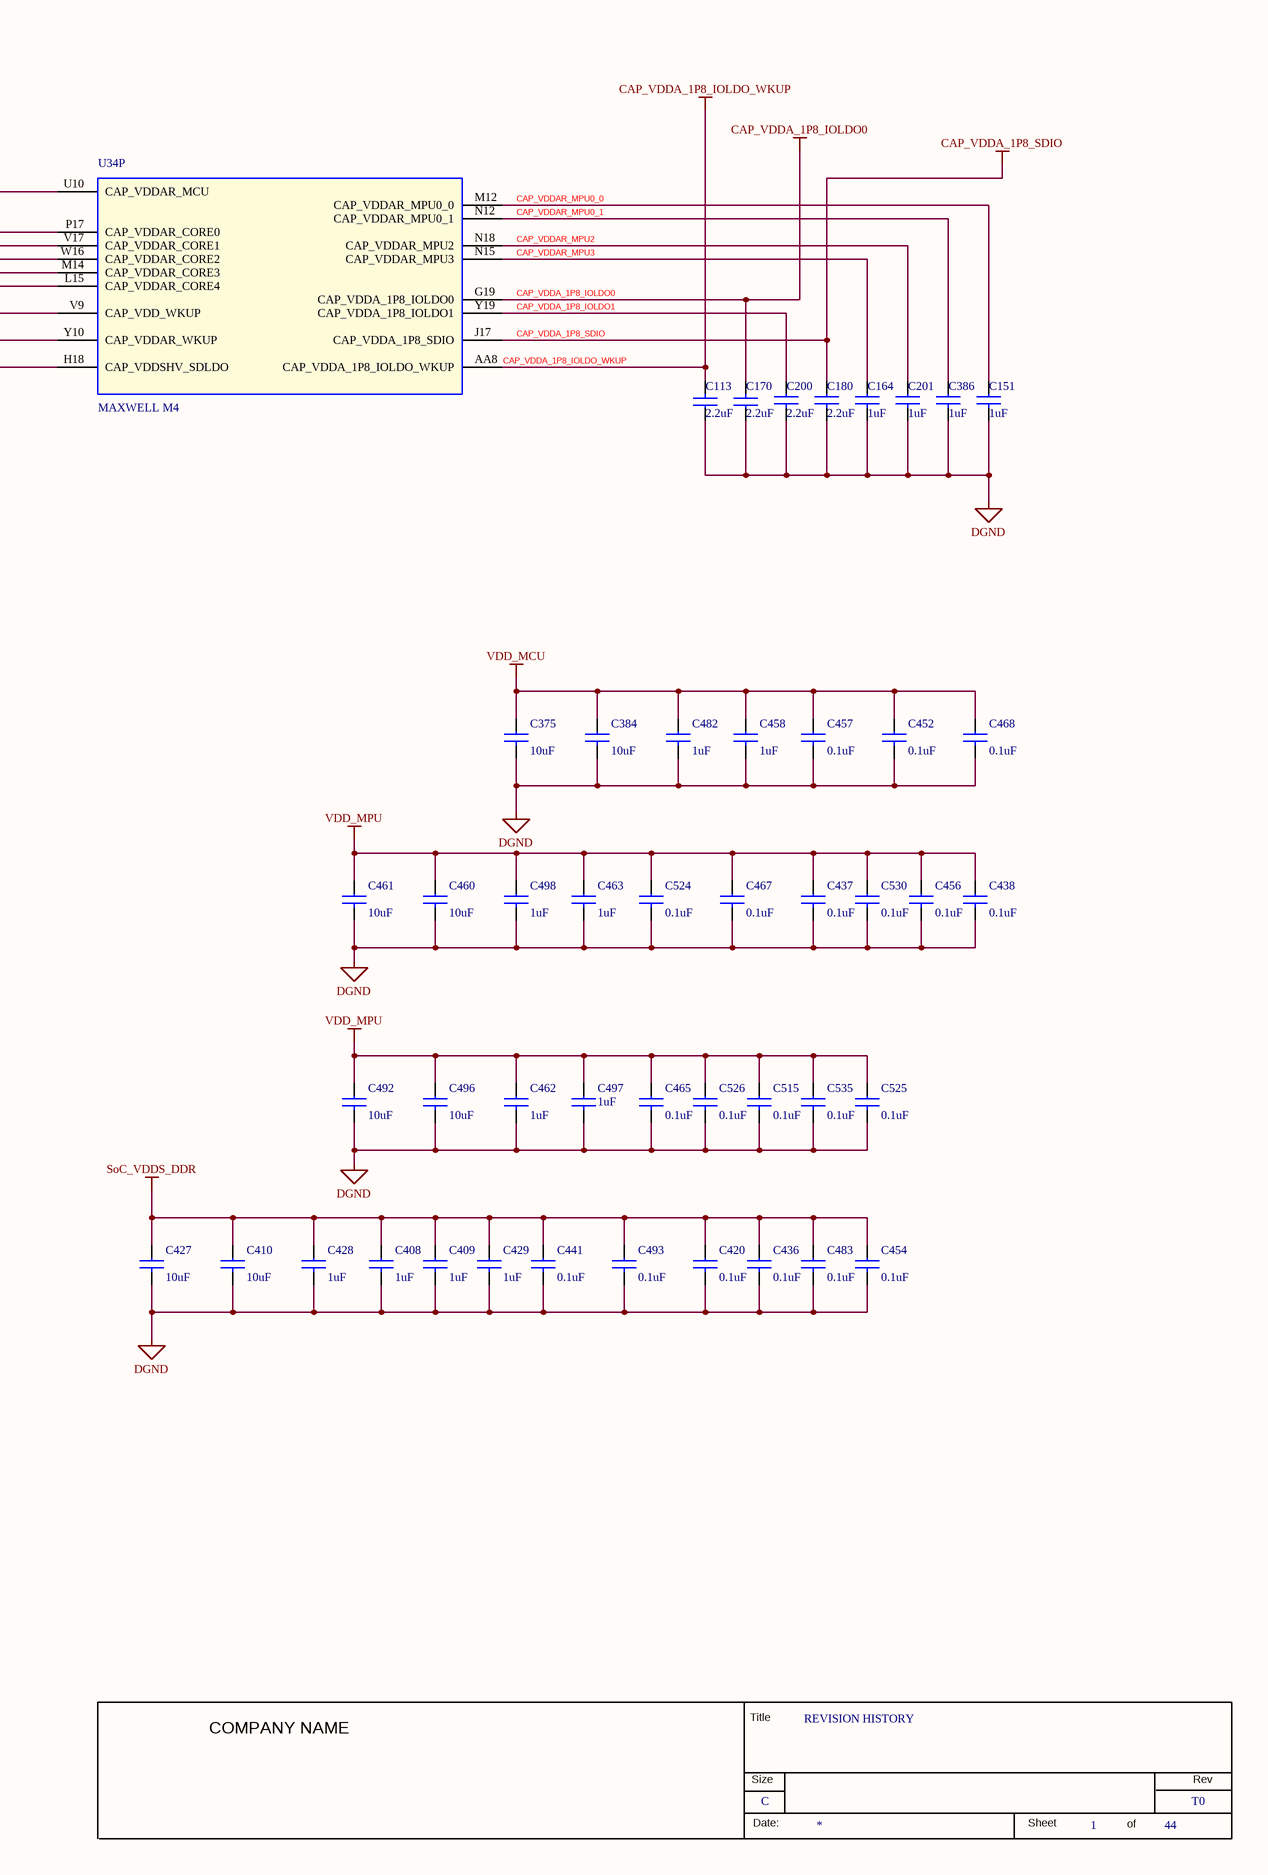
[diagram p14: 11-SoC POWER1.SchDoc, right]

### Parts
(Parts that share a designator on the sheet are numbered #1, #2 ... from top to bottom, then left to right.)
*#11  RevCode: T0  Title: REVISION HISTORY  Page Size: C  Page Number: 1  Page Count: 44  (hidden comment: TRAINING_TITLEBLK_CSIZE)  (graphical)
C113  2.2uF  [CAP0603]
C114  1uF  [CAP0402_0-75]
C115  2.2uF  [CAP0402_0-75]
C116  1uF  [CAP0402_0-75]
C151  1uF  [CAP0402_0-75]
C157  1uF  [CAP0402_0-75]
C158  1uF  [CAP0402_0-75]
C159  1uF  [CAP0402_0-75]
C164  1uF  [CAP0402_0-75]
C165  1uF  [CAP0402_0-75]
C167  1uF  [CAP0402_0-75]
C170  2.2uF  [CAP0603]
C180  2.2uF  [CAP0402_0-75]
C200  2.2uF  [CAP0402_0-75]
C201  1uF  [CAP0402_0-75]
C373  10uF  [CAP0603_1]
C374  10uF  [CAP0603_1]
C375  10uF  [CAP0603_1]
C376  10uF  [CAP0603_1]
C377  10uF  [CAP0603_1]
C382  1uF  [CAP0402_0-75]
C383  1uF  [CAP0402_0-75]
C384  10uF  [CAP0603_1]
C386  1uF  [CAP0402_0-75]
C390  1uF  [CAP0402_0-75]
C391  1uF  [CAP0402_0-75]
C408  1uF  [CAP0402_0-75]
C409  1uF  [CAP0402_0-75]
C410  10uF  [CAP0603_1]
C420  0.1uF  [CAP0201_0-5]
C427  10uF  [CAP0603_1]
C428  1uF  [CAP0402_0-75]
C429  1uF  [CAP0402_0-75]
C431  0.1uF  [CAP0201_0-5]
C436  0.1uF  [CAP0201_0-5]
C437  0.1uF  [CAP0201_0-5]
C438  0.1uF  [CAP0201_0-5]
C441  0.1uF  [CAP0201_0-5]
C451  0.1uF  [CAP0201_0-5]
C452  0.1uF  [CAP0201_0-5]
C454  0.1uF  [CAP0201_0-5]
C456  0.1uF  [CAP0201_0-5]
C457  0.1uF  [CAP0201_0-5]
C458  1uF  [CAP0402_0-75]
C460  10uF  [CAP0603_1]
C461  10uF  [CAP0603_1]
C462  1uF  [CAP0402_0-75]
C463  1uF  [CAP0402_0-75]
C465  0.1uF  [CAP0201_0-5]
C467  0.1uF  [CAP0201_0-5]
C468  0.1uF  [CAP0201_0-5]
C469  0.1uF  [CAP0201_0-5]
C473  0.1uF  [CAP0201_0-5]
C476  0.1uF  [CAP0201_0-5]
C479  0.1uF  [CAP0201_0-5]
C482  1uF  [CAP0402_0-75]
C483  0.1uF  [CAP0201_0-5]
C484  0.1uF  [CAP0201_0-5]
C485  0.1uF  [CAP0201_0-5]
C486  0.1uF  [CAP0201_0-5]
C487  0.1uF  [CAP0201_0-5]
C488  0.1uF  [CAP0201_0-5]
C490  0.1uF  [CAP0201_0-5]
C491  0.1uF  [CAP0201_0-5]
C492  10uF  [CAP0603_1]
C493  0.1uF  [CAP0201_0-5]
C494  0.1uF  [CAP0201_0-5]
C496  10uF  [CAP0603_1]
C497  1uF  [CAP0402_0-75]
C498  1uF  [CAP0402_0-75]
C500  0.1uF  [CAP0201_0-5]
C502  1uF  [CAP0402_0-75]
C503  1uF  [CAP0402_0-75]
C509  1uF  [CAP0402_0-75]
C510  1uF  [CAP0402_0-75]
C511  1uF  [CAP0402_0-75]
C515  0.1uF  [CAP0201_0-5]
C516  1uF  [CAP0402_0-75]
C517  0.1uF  [CAP0201_0-5]
C518  0.1uF  [CAP0201_0-5]
C520  0.1uF  [CAP0201_0-5]
C524  0.1uF  [CAP0201_0-5]
C525  0.1uF  [CAP0201_0-5]
C526  0.1uF  [CAP0201_0-5]
C530  0.1uF  [CAP0201_0-5]
C531  0.1uF  [CAP0201_0-5]
C532  0.1uF  [CAP0201_0-5]
C533  0.1uF  [CAP0201_0-5]
C534  1uF  [CAP0402_0-75]
C535  0.1uF  [CAP0201_0-5]
C539  0.1uF  [CAP0201_0-5]
C541  2.2uF  [CAP0402_0-75]
C543  0.1uF  [CAP0201_0-5]
C550  1uF  [CAP0402_0-75]
U34  MAXWELL M4  [BGA784_31-49_910X910_1-7]  (parts P,Q of 19)

### Nets
CAP_VDD_WKUP: C115.1 U34.V9(CAP_VDD_WKUP)
CAP_VDDA_1P8_IOLDO0: C170.2 U34.G19(CAP_VDDA_1P8_IOLDO0)
CAP_VDDA_1P8_IOLDO_WKUP: C113.2 U34.AA8(CAP_VDDA_1P8_IOLDO_WKUP)
CAP_VDDA_1P8_SDIO: C180.1 U34.J17(CAP_VDDA_1P8_SDIO)
CAP_VDDSHV_SDLDO: C541.1 U34.H18(CAP_VDDSHV_SDLDO)
DGND: C113.1 C114.2 C115.2 C116.2 C151.2 C157.2 C158.2 C159.2 C164.2 C165.2 C167.2 C170.1 C180.2 C200.2 C201.2 C373.2 C374.2 C375.2 C376.2 C377.2 C382.2 C383.2 C384.2 C386.2 C390.2 C391.2 C408.2 C409.2 C410.2 C420.2 C427.2 C428.2 C429.2 C431.2 C436.2 C437.2 C438.2 C441.2 C451.2 C452.2 C454.2 C456.2 C457.2 C458.2 C460.2 C461.2 C462.2 C463.2 C465.2 C467.2 C468.2 C469.2 C473.2 C476.2 C479.2 C482.2 C483.2 C484.2 C485.2 C486.2 C487.2 C488.2 C490.2 C491.2 C492.2 C493.2 C494.2 C496.2 C497.2 C498.2 C500.2 C502.2 C503.2 C509.2 C510.2 C511.2 C515.2 C516.2 C517.2 C518.2 C520.2 C524.2 C525.2 C526.2 C530.2 C531.2 C532.2 C533.2 C534.2 C535.2 C539.2 C541.2 C543.2 C550.2
SoC_VDDS_DDR: C408.1 C409.1 C410.1 C420.1 C427.1 C428.1 C429.1 C436.1 C441.1 C454.1 C483.1 C493.1 U34.G8(VDDS_DDR) U34.G10(VDDS_DDR) U34.G14(VDDS_DDR) U34.H7(VDDS_DDR) U34.H9(VDDS_DDR) U34.H13(VDDS_DDR)
VDD_CORE: C373.1 C374.1 C376.1 C377.1 C382.1 C383.1 C390.1 C391.1 C431.1 C451.1 C469.1 C473.1 C476.1 C479.1 C484.1 C485.1 C486.1 C487.1 C488.1 C490.1 C491.1 C494.1 C500.1 C502.1 C503.1 C509.1 C510.1 C511.1 C516.1 C517.1 C518.1 C520.1 C531.1 C532.1 C533.1 C534.1 C539.1 C543.1 C550.1 U34.AA12(VDD) U34.J8(VDD) U34.J10(VDD) U34.J12(VDD) U34.J14(VDD) U34.J19(VDD) U34.K13(VDD) U34.L14(VDD) U34.L19(VDD) U34.M13(VDD) U34.N14(VDD) U34.P13(VDD) U34.P15(VDD) U34.P19(VDD) U34.R14(VDD) U34.R16(VDD) U34.R18(VDD) U34.T13(VDD) U34.T15(VDD) U34.T17(VDD) U34.T19(VDD) U34.U14(VDD) U34.U16(VDD) U34.U18(VDD) U34.V13(VDD) U34.V15(VDD) U34.V19(VDD) U34.W14(VDD) U34.W18(VDD) U34.Y11(VDD) U34.Y13(VDD) U34.Y15(VDD)
VDD_MCU: C375.1 C384.1 C452.1 C457.1 C458.1 C468.1 C482.1 U34.N10(VDD_MCU) U34.P11(VDD_MCU) U34.R10(VDD_MCU) U34.R12(VDD_MCU) U34.T11(VDD_MCU)
VDD_MPU: C437.1 C438.1 C456.1 C460.1 C461.1 C462.1 C463.1 C465.1 C467.1 C492.1 C496.1 C497.1 C498.1 C515.1 C524.1 C525.1 C526.1 C530.1 C535.1 U34.K9(VDD_MPU0) U34.K11(VDD_MPU0) U34.K16(VDD_MPU1) U34.K18(VDD_MPU1) U34.L8(VDD_MPU0) U34.L10(VDD_MPU0) U34.L17(VDD_MPU1) U34.M11(VDD_MPU0) U34.M16(VDD_MPU1) U34.M18(VDD_MPU1) U34.N17(VDD_MPU1)
CAP_VDDA_1P8_IOLDO1: C200.1 U34.Y19(CAP_VDDA_1P8_IOLDO1)
CAP_VDDAR_CORE0: C167.1 U34.P17(CAP_VDDAR_CORE0)
CAP_VDDAR_CORE1: C165.1 U34.V17(CAP_VDDAR_CORE1)
CAP_VDDAR_CORE2: C159.1 U34.W16(CAP_VDDAR_CORE2)
CAP_VDDAR_CORE3: C157.1 U34.M14(CAP_VDDAR_CORE3)
CAP_VDDAR_CORE4: C158.1 U34.L15(CAP_VDDAR_CORE4)
CAP_VDDAR_MCU: C116.1 U34.U10(CAP_VDDAR_MCU)
CAP_VDDAR_MPU0_0: C151.1 U34.M12(CAP_VDDAR_MPU0_0)
CAP_VDDAR_MPU0_1: C386.1 U34.N12(CAP_VDDAR_MPU0_1)
CAP_VDDAR_MPU2: C201.1 U34.N18(CAP_VDDAR_MPU2)
CAP_VDDAR_MPU3: C164.1 U34.N15(CAP_VDDAR_MPU3)
CAP_VDDAR_WKUP: C114.1 U34.Y10(CAP_VDDAR_WKUP)

### Notes on the sheet
- PROCESSOR POWER & DECAPS
- (in symbol TRAINING_TITLEBLK_CSIZE) Title; COMPANY NAME; Size; Rev; Date:; Sheet; of

### Library data of the parts
*#11 = TRAINING_TITLEBLK_CSIZE: Issue: 1.0; Page Create Date: Jan  8, 2022; Page Modify Date: *
C113 C170 = CAP_Dup5: CAP CERAMIC 2.2uF 10V 10% X5R 0603; Mistral Part No: 120009030289-R; Mfr_name: KEMET; Mfr_part_number: C0603C225K8PACTU; Part_type: CAPACITORS\CERAMIC; Alternate_mfr_name_C: PANASONIC-ECG; Alternate_mfr_part_number_C: ECJ-1VB1A225K; Project: PMP LCD BOARD; Customs_HS_Code: 85322990; Custom_Duty: 15%; Library Ref: CAP; Tolerance: 10%; Voltage: 10V; Package: 0603; Distributor_name: MOUSER; Distributor_part_number: 80-C0603C225K8P; Height: 0.90MM; Datasheet: Y:\MIS_DATABASE\DATASHEETS\CAPACITORS\KEMET-C08.PDF; Crtd /date: MAZHAR/291106; Chkd/date: SHREESHAIL/280507; Distributor_name_C: DIGIKEY; Distributor_part_number_C: PCC2397CT-ND; PCB Footprint: CAP0603
C114 C151 C157 C159 C164 C165 C382 C383 C386 C390 C391 C408 C409 C458 C497 C502 C509 C510 C550 = CAP_Dup5: CAP CERAMIC 1uF 16V 20% X5R 0402; Part_type: CAPACITORS\CERAMIC; Mfr_part_number: EMK105BJ105MV-F; Mfr_name: TAIYO YUDEN; Mistral Part No: 120018020006-R; Custom_Duty: 15%; Customs_HS_Code: 85322990; Wattage: NA; Project: TI_MAXIE_CPB; Footprint Ref: CAP0402_0-75; Library Ref: CAP; Chkd/date: MANIRAJA/150218; Crtd /date: ALVY/150218; Datasheet: Y:\MIS_DATABASE\DATASHEETS\CAPACITORS\EMK105BJ105MV-F.PDF; Temperature: -55°C+85°C; Weight: 0.65mg; Height: 0.55MM; Distributor_part_number: 587-5514-1-ND; Distributor_name: DIGIKEY; Package: 0402; Voltage: 16V; Tolerance: 20%; PCB Footprint: CAP0402_0-75; MECHANICAL 3D STEP FILE: CAP0402_0-75; Library Path: Y:\MIS_DATABASE\Library\ALTIUM_TOOL\SCHEMATICS_PARTS\MS_DISCRETE_Library.schlib; Footprint Path: Y:\MIS_DATABASE\Library\ALTIUM_TOOL\PCB_FOOTPRINTS\Altium_Footprint_Lib.PcbLib
C115 C180 C200 C541 = CAP_Dup5: CAP CERAMIC 2.2uF 10V 20% X5R 0402; Mistral Part No: 120018010016-R; Mfr_name: MURATA; Mfr_part_number: GRT155R61A225ME01D; Part_type: CAPACITORS\CERAMIC; Project: TI_MAXIE_CPB; Wattage: NA; Customs_HS_Code: 85322990; Custom_Duty: 15%; Library Ref: CAP; Tolerance: 20%; Voltage: 10V; Package: 0402; Distributor_name: DIGIKEY; Distributor_part_number: 490-12254-1-ND; Height: 0.55MM; Weight: 0.65mg; Temperature: -55°C+85°C; Datasheet: Y:\MIS_DATABASE\DATASHEETS\CAPACITORS\GRT155R61A225ME01.PDF; Crtd /date: MANIRAJA/240118; Chkd/date: MANIRAJA/240118; PCB Footprint: CAP0402_0-75; MECHANICAL 3D STEP FILE: CAP0402_0-75
C116 C158 C167 C201 C428 C429 C462 C463 C482 C498 C503 C511 C516 C534 = CAP_Dup5: CAP CERAMIC 1uF 16V 20% X5R 0402; Mistral Part No: 120018020006-R; Mfr_name: TAIYO YUDEN; Mfr_part_number: EMK105BJ105MV-F; Part_type: CAPACITORS\CERAMIC; Project: TI_MAXIE_CPB; Wattage: NA; Customs_HS_Code: 85322990; Custom_Duty: 15%; Footprint Ref: CAP0402_0-75; Library Ref: CAP; Tolerance: 20%; Voltage: 16V; Package: 0402; Distributor_name: DIGIKEY; Distributor_part_number: 587-5514-1-ND; Height: 0.55MM; Weight: 0.65mg; Temperature: -55°C+85°C; Datasheet: Y:\MIS_DATABASE\DATASHEETS\CAPACITORS\EMK105BJ105MV-F.PDF; Crtd /date: ALVY/150218; Chkd/date: MANIRAJA/150218; PCB Footprint: CAP0402_0-75; MECHANICAL 3D STEP FILE: CAP0402_0-75; Library Path: Y:\MIS_DATABASE\Library\ALTIUM_TOOL\SCHEMATICS_PARTS\MS_DISCRETE_Library.schlib; Footprint Path: Y:\MIS_DATABASE\Library\ALTIUM_TOOL\PCB_FOOTPRINTS\Altium_Footprint_Lib.PcbLib
C373 C374 C376 C460 C461 C492 C496 = CAP_Dup5: CAP CERAMIC 10uF 10V 10% X5R 0603; Part_type: CAPACITORS\CERAMIC; Mfr_part_number: 0603ZD106KAT2A; Mfr_name: AVX CORPORATION; Mistral Part No: 120010080001-R; Wattage: NA; Custom_Duty: 15%; Customs_HS_Code: 85322990; Project: TI_MAXIE_CPB; MECHANICAL 3D STEP FILE: CAP0603_1; Temperature: -55°C+85°C; Weight: 2mg; Chkd/date: MANIRAJA/230118; Crtd /date: MANIRAJA/230118; Datasheet: Y:\MIS_DATABASE\DATASHEETS\CAPACITORS\AVX_MLC.PDF; Height: 0.94MM; Distributor_part_number: 478-10766-1-ND; Distributor_name: DIGIKEY; Package: 0603; Voltage: 10V; Tolerance: 10%; Library Ref: CAP; PCB Footprint: CAP0603_1
C375 C377 C384 C410 C427 = CAP_Dup5: CAP CERAMIC 10uF 10V 10% X5R 0603; Mistral Part No: 120010080001-R; Mfr_name: AVX CORPORATION; Mfr_part_number: 0603ZD106KAT2A; Part_type: CAPACITORS\CERAMIC; Wattage: NA; Project: TI_MAXIE_CPB; Customs_HS_Code: 85322990; Custom_Duty: 15%; MECHANICAL 3D STEP FILE: CAP0603_1; Temperature: -55°C+85°C; Weight: 2mg; Tolerance: 10%; Voltage: 10V; Package: 0603; Distributor_name: DIGIKEY; Distributor_part_number: 478-10766-1-ND; Height: 0.94MM; Datasheet: Y:\MIS_DATABASE\DATASHEETS\CAPACITORS\AVX_MLC.PDF; Crtd /date: MANIRAJA/230118; Chkd/date: MANIRAJA/230118; Library Ref: CAP; PCB Footprint: CAP0603_1
C420 C437 C441 C452 C454 C456 C465 C473 C486-C488 C490 C494 C517 C518 C520 C524 C526 C535 C543 = CAP_Dup5: as C240 on sheet 10-SoC CLOCK AND RESET; Library Ref: CAP; PCB Footprint: CAP0201_0-5; Tolerance: 10%; Voltage: 16V; Package: 0201; Distributor_name: DIGIKEY; Distributor_part_number: 490-16742-1-ND; Height: 0.33MM; Weight: 0.33mg; Temperature: -55°C+85°C; Datasheet: Y:\MIS_DATABASE\DATASHEETS\CAPACITORS\GRM033R61C104KE84.PDF; Crtd /date: MANIRAJA/120218; Chkd/date: MANIRAJA/120218; MECHANICAL 3D STEP FILE: CAP0201_0-5
C431 C436 C438 C451 C457 C467-C469 C476 C479 C483-C485 C491 C493 C500 C515 C525 C530-C533 C539 = CAP_Dup5: as C237 on sheet 10-SoC CLOCK AND RESET; Library Ref: CAP; PCB Footprint: CAP0201_0-5; MECHANICAL 3D STEP FILE: CAP0201_0-5; Chkd/date: MANIRAJA/120218; Crtd /date: MANIRAJA/120218; Datasheet: Y:\MIS_DATABASE\DATASHEETS\CAPACITORS\GRM033R61C104KE84.PDF; Temperature: -55°C+85°C; Weight: 0.33mg; Height: 0.33MM; Distributor_part_number: 490-16742-1-ND; Distributor_name: DIGIKEY; Package: 0201; Voltage: 16V; Tolerance: 10%
U34 = AM654X_BGA784: IC MAXWELL MICRO CONTROLLER UNIT BGA784; Mistral Part No: 141217100003; Mfr_name: TEXAS INSTRUMENTS; Mfr_part_number: MAXWELL M4_EVM; Part_type: ICS\DIGITAL\MICROCONTROLLER; Project: TI_MAXIE_CPB; Tolerance: NA; Customs_HS_Code: 85423100; Custom_Duty: 15%; Library Ref: AM654X_BGA784; Voltage: NA; Wattage: NA; Package: BGA784; Distributor_name: NA; Distributor_part_number: NA; Height: 1.63MM; Weight: NA; Temperature: NA; Datasheet: Y:\MIS_DATABASE\DATASHEETS\ICS\DIGITAL\MICROCONTROLLER\MAXWELLM4.PDF; Crtd /date: MANIRAJA/130717; Chkd/date: MANIRAJA/130717; MECHANICAL 3D STEP FILE: BGA784_31-49_910X910_1-7; PCB Footprint: BGA784_31-49_910X910_1-7